# Altium project ZYNQ7000_Core_V1.1.PrjPcb (part 1 of 2)
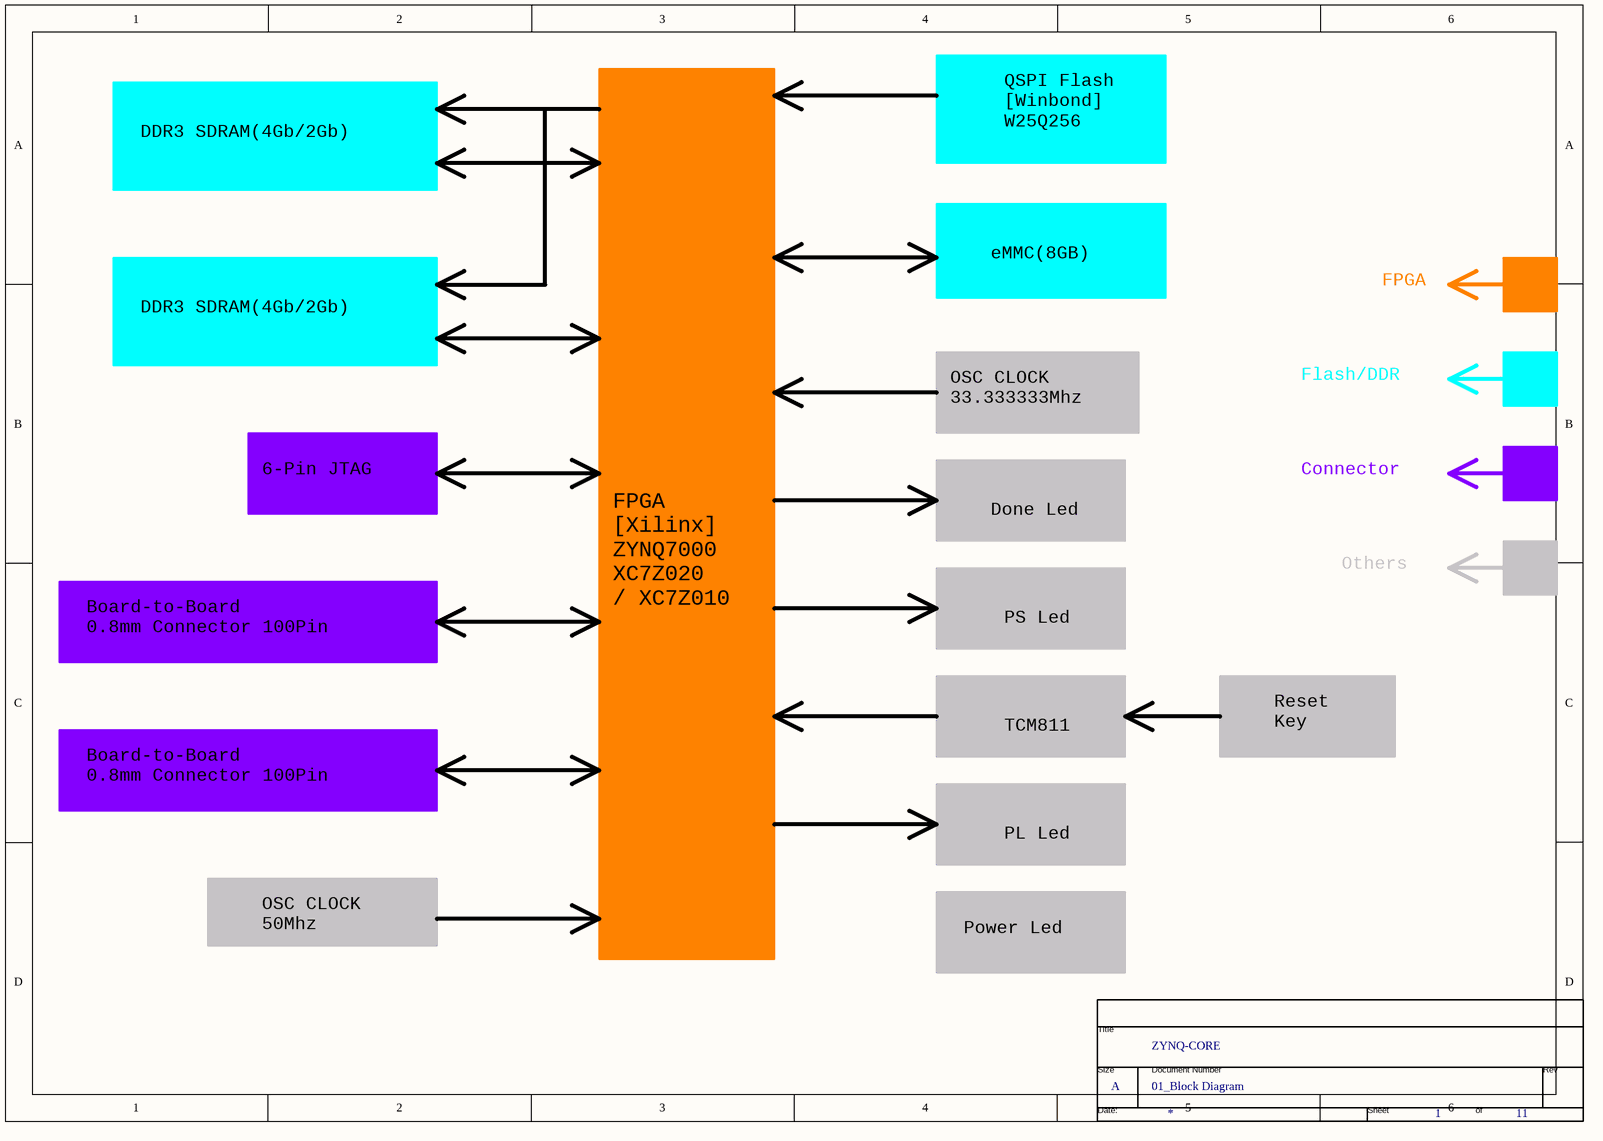
[diagram p0: 01_Block Diagram.SchDoc]
11 sheets, 361 parts. Net scope: global (net labels, ports and power ports of the same name join across sheets).
Board file: ZYNQ7000_Core_V1.1-Finish.PcbDoc
Sheets:
  01_Block Diagram.SchDoc
  02_FPGA Bank0.SchDoc
  03_Bank13_Bank34_Bank35.SchDoc
  04_FPGA Bank500_Bank501.SchDoc
  05_FPGA Bank502.SchDoc
  06_FPGA POWER.SchDoc
  07_DDR3.SchDoc
  08_eMMC.SchDoc
  09_POWER.SchDoc
  10_Ethernet-YT8521SC_CA.SchDoc
  11_CONNECTOR.SchDoc

## Sheet 01_Block Diagram.SchDoc
size 297 x 209 mm

### Parts
(Parts that share a designator on the sheet are numbered #1, #2 ... from top to bottom, then left to right.)
*#1  Page Count: 11  Page Number: 1  Page Size: A  Title: ZYNQ-CORE  Doc: 01_Block Diagram  (hidden comment: TitleBlock0)  (graphical)

### Notes on the sheet
- DDR3 SDRAM(4Gb/2Gb)
- QSPI Flash
  [Winbond]
  W25Q256
- eMMC(8GB)
- FPGA
- Flash/DDR
- 6-Pin JTAG
- OSC CLOCK
  33.333333Mhz
- Connector
- Done Led
- Others
- Board-to-Board
  0.8mm Connector 100Pin
- FPGA
  [Xilinx]
  ZYNQ7000
  XC7Z020
  / XC7Z010
- PS Led
- TCM811
- Reset
  Key
- PL Led
- OSC CLOCK
  50Mhz
- Power Led
- (in symbol TitleBlock0) Title; Size; Document Number; Rev; Date:; Sheet; of

### Library data of the parts
*#1 = TitleBlock0: Page Create Date: March  8, 1995; Page Modify Date: *

## Sheet 02_FPGA Bank0.SchDoc
size 297 x 209 mm
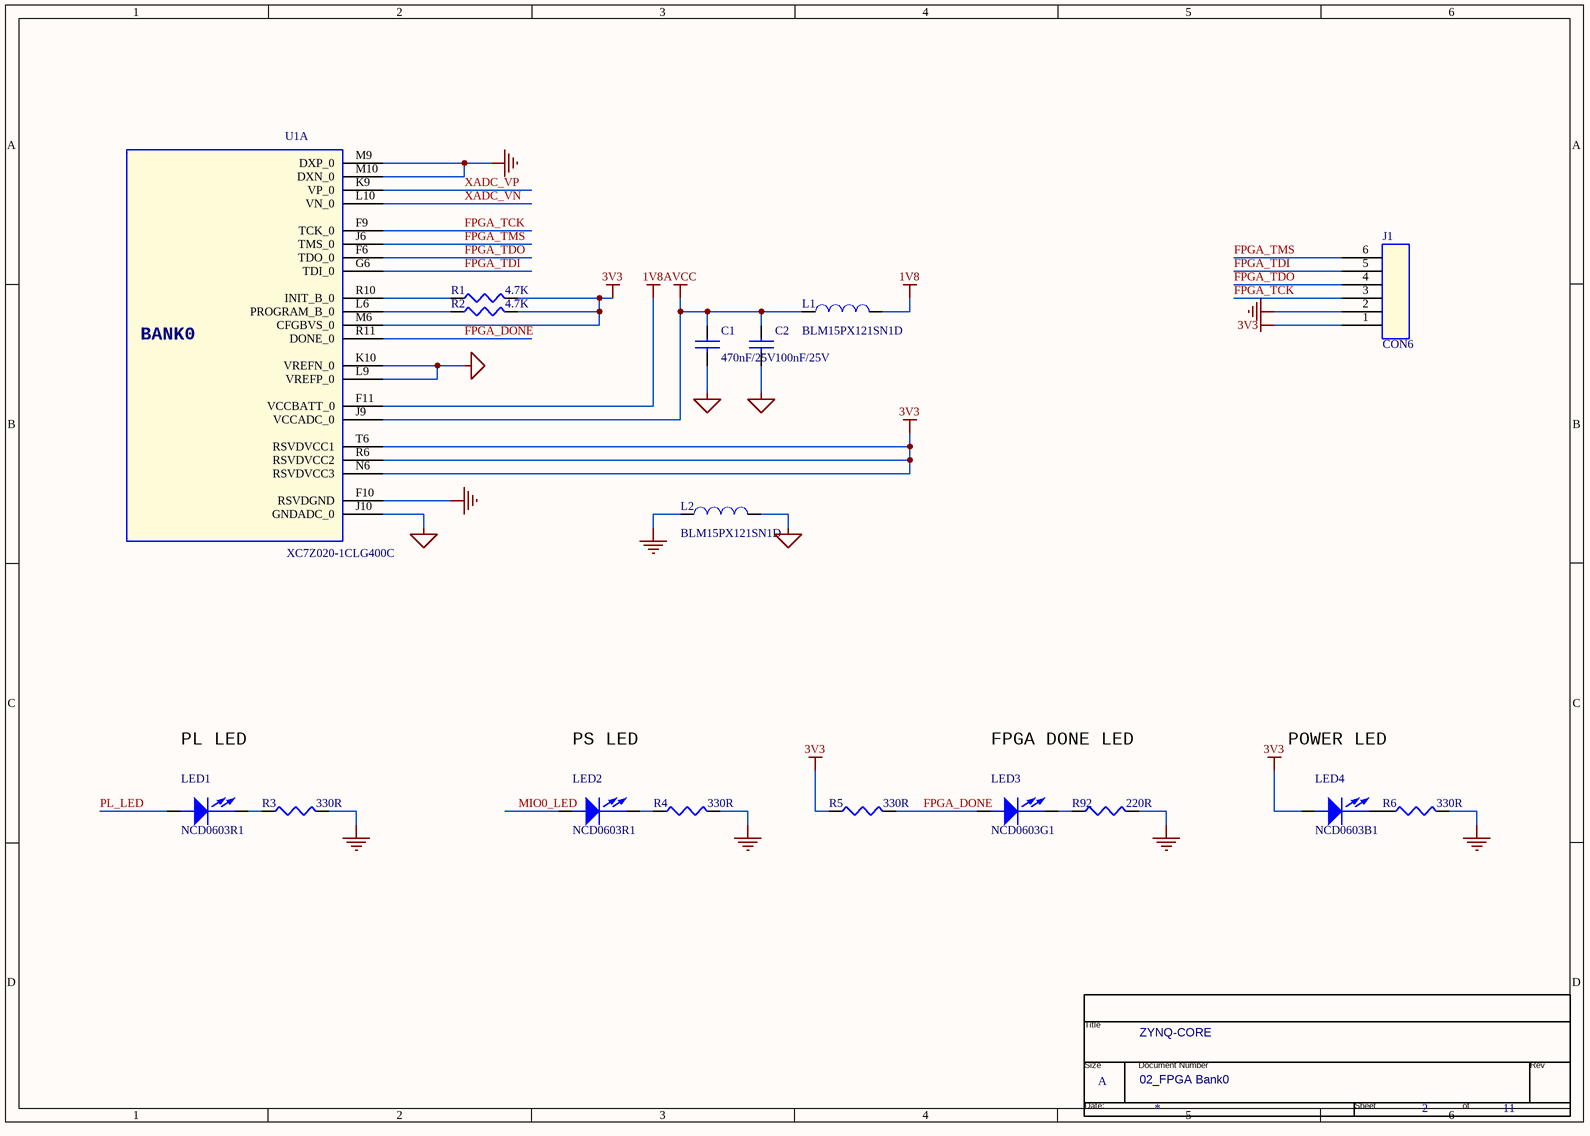
[diagram p1: 02_FPGA Bank0.SchDoc]

### Parts
(Parts that share a designator on the sheet are numbered #1, #2 ... from top to bottom, then left to right.)
*#2  Page Count: 11  Page Number: 2  Page Size: A  Title: ZYNQ-CORE  Doc: 02_FPGA Bank0  (hidden comment: TitleBlock0)  (graphical)
C1  470nF/25V  [C0402]
C2  100nF/25V  [C0402]
J1  CON6  [HDR1X6]
L1  BLM15PX121SN1D  [L0402]
L2  BLM15PX121SN1D  [L0402]
LED1  NCD0603R1  [LED0603_M_RED]
LED2  NCD0603R1  [LED0603_M_RED]
LED3  NCD0603G1  [LED0603_M_GREEN]
LED4  NCD0603B1  [LED0603_M_BLUE]
R1  4.7K  [R0402A]
R2  4.7K  [R0402A]
R3  330R  [R0402]
R4  330R  [R0402]
R5  330R  [R0402]
R6  330R  [R0402]
R92  220R  [R0402]
U1  XC7Z020-1CLG400C  [CLG400]  (part A of 9)

### Nets
1V8: L1.2 U1.F11(VCCBATT_0)
3V3: J1.1 LED4.1(ANODE) R1.2 R2.2 R5.1 U1.M6(CFGBVS_0) U1.N6(RSVDVCC3) U1.R6(RSVDVCC2) U1.T6(RSVDVCC1)
AGND: C1.2 C2.2 L2.2 U1.J10(GNDADC_0) U1.K10(VREFN_0) U1.L9(VREFP_0)
AVCC: C1.1 C2.1 L1.1 U1.J9(VCCADC_0)
GND: J1.2 L2.1 R3.2 R4.2 R6.2 R92.2 U1.F10(RSVDGND) U1.M9(DXP_0) U1.M10(DXN_0)
FPGA_DONE: LED3.1(ANODE) R5.2 U1.R11(DONE_0)
FPGA_TCK: J1.3 U1.F9(TCK_0)
FPGA_TDI: J1.5 U1.G6(TDI_0)
FPGA_TDO: J1.4 U1.F6(TDO_0)
FPGA_TMS: J1.6 U1.J6(TMS_0)
MIO0_LED: LED2.1(ANODE)
PL_LED: LED1.1(ANODE)
XADC_VN: U1.L10(VN_0)
XADC_VP: U1.K9(VP_0)
NetLED1_2: LED1.2(CATHODE) R3.1
NetLED2_2: LED2.2(CATHODE) R4.1
NetLED3_2: LED3.2(CATHODE) R92.1
NetLED4_2: LED4.2(CATHODE) R6.1
NetR1_1: R1.1 U1.R10(INIT_B_0)
NetR2_1: R2.1 U1.L6(PROGRAM_B_0)

### Notes on the sheet
- PL LED
- PS LED
- FPGA DONE LED
- POWER LED
- (in symbol TitleBlock0) Title; Size; Document Number; Rev; Date:; Sheet; of
- (in symbol Zynq7010/7020, part A) BANK0

### Library data of the parts
C1 C2 = CAP NP_Dup1: PCB Footprint: C0402
L1 L2 = INDUCTOR_Dup1: PCB Footprint: L0402
LED1 LED2 = LED: 红色; PCB Footprint: LED0805
LED3 = LED: 绿色; PCB Footprint: LED0805
LED4 = LED: 蓝色; PCB Footprint: LED0805
R1 R2 = RESISTOR_Dup1: PCB Footprint: R0402
R3-R6 R92 = RESISTOR_Dup1: PCB Footprint: R0402
U1 = Zynq7010/7020: PCB Footprint: CLG400
*#2 = TitleBlock0: Page Create Date: March  8, 1995; Page Modify Date: *
J1 = CON6: PCB Footprint: HDR1X6

## Sheet 03_Bank13_Bank34_Bank35.SchDoc
size A3
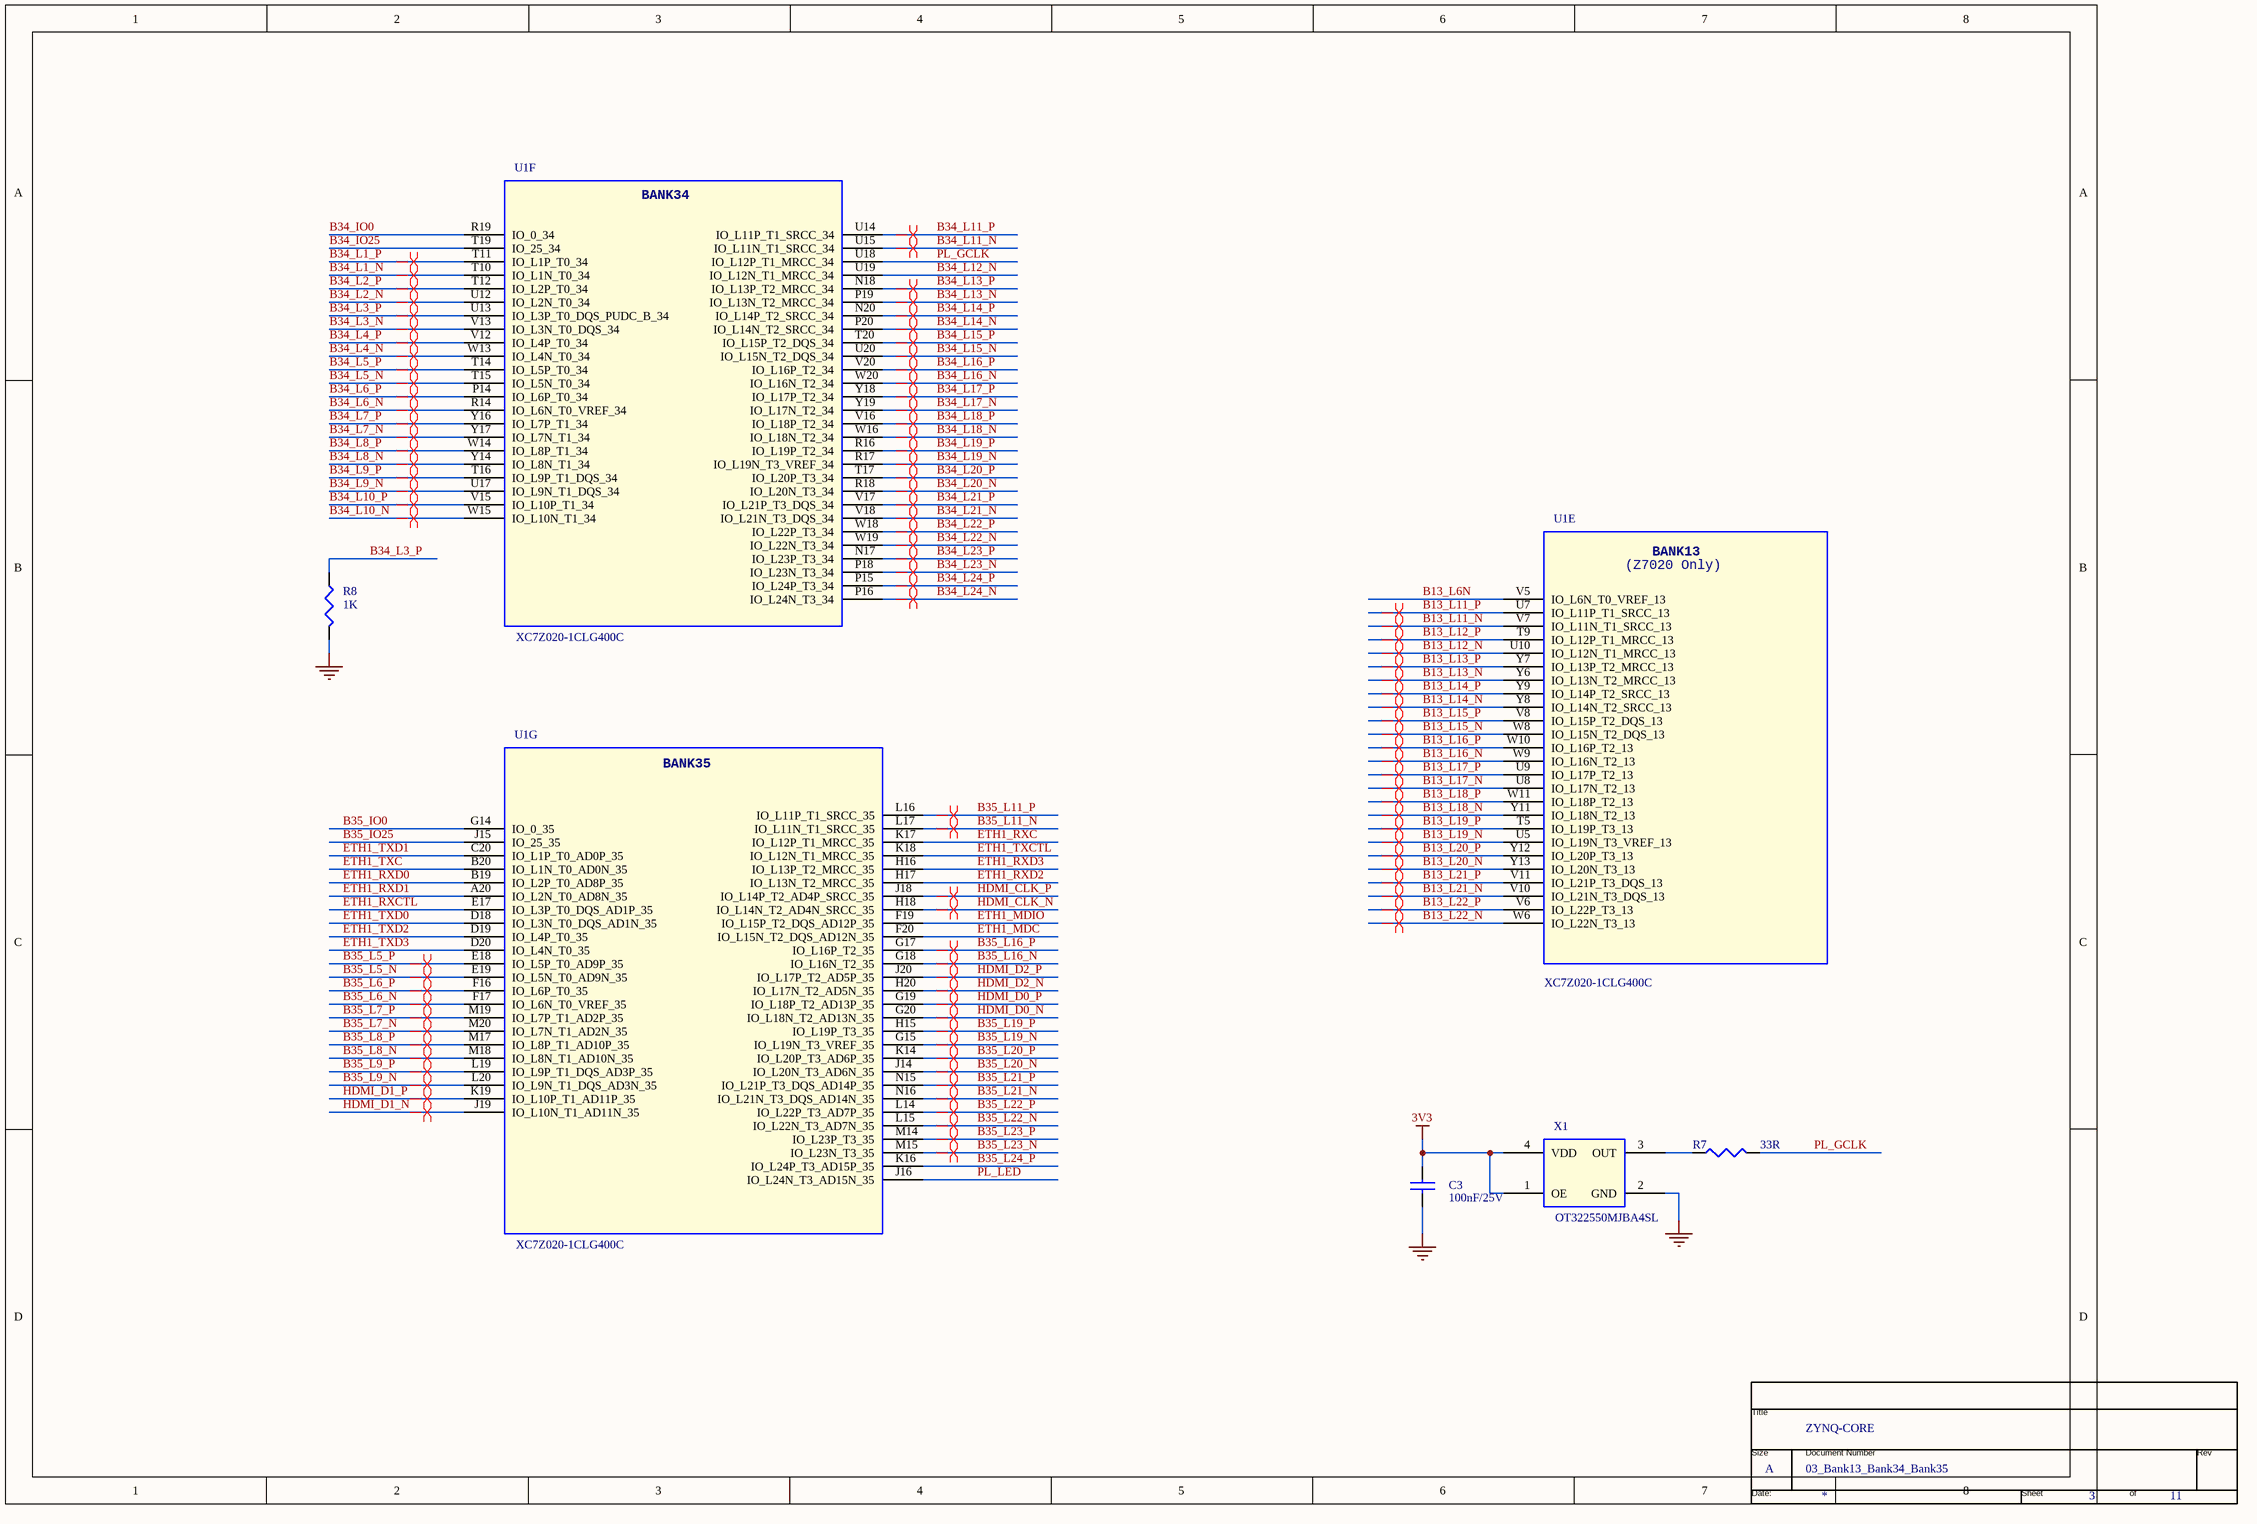
[diagram p2: 03_Bank13_Bank34_Bank35.SchDoc]

### Parts
(Parts that share a designator on the sheet are numbered #1, #2 ... from top to bottom, then left to right.)
*#3  Page Count: 11  Page Number: 3  Page Size: A  Title: ZYNQ-CORE  Doc: 03_Bank13_Bank34_Bank35  (hidden comment: TitleBlock0)  (graphical)
C3  100nF/25V  [C0402]
R7  33R  [R0402]
R8  1K  [R0402A]
U1  XC7Z020-1CLG400C  [CLG400]  (parts E,F,G of 9)
X1  OT322550MJBA4SL  [OSC3_2X2_5]

### Nets
3V3: C3.1 X1.1(OE) X1.4(VDD)
GND: C3.2 R8.2 X1.2(GND)
B13_L6N: U1.V5(IO_L6N_T0_VREF_13)
B13_L11_N: U1.V7(IO_L11N_T1_SRCC_13)
B13_L11_P: U1.U7(IO_L11P_T1_SRCC_13)
B13_L12_N: U1.U10(IO_L12N_T1_MRCC_13)
B13_L12_P: U1.T9(IO_L12P_T1_MRCC_13)
B13_L13_N: U1.Y6(IO_L13N_T2_MRCC_13)
B13_L13_P: U1.Y7(IO_L13P_T2_MRCC_13)
B13_L14_N: U1.Y8(IO_L14N_T2_SRCC_13)
B13_L14_P: U1.Y9(IO_L14P_T2_SRCC_13)
B13_L15_N: U1.W8(IO_L15N_T2_DQS_13)
B13_L15_P: U1.V8(IO_L15P_T2_DQS_13)
B13_L16_N: U1.W9(IO_L16N_T2_13)
B13_L16_P: U1.W10(IO_L16P_T2_13)
B13_L17_N: U1.U8(IO_L17N_T2_13)
B13_L17_P: U1.U9(IO_L17P_T2_13)
B13_L18_N: U1.Y11(IO_L18N_T2_13)
B13_L18_P: U1.W11(IO_L18P_T2_13)
B13_L19_N: U1.U5(IO_L19N_T3_VREF_13)
B13_L19_P: U1.T5(IO_L19P_T3_13)
B13_L20_N: U1.Y13(IO_L20N_T3_13)
B13_L20_P: U1.Y12(IO_L20P_T3_13)
B13_L21_N: U1.V10(IO_L21N_T3_DQS_13)
B13_L21_P: U1.V11(IO_L21P_T3_DQS_13)
B13_L22_N: U1.W6(IO_L22N_T3_13)
B13_L22_P: U1.V6(IO_L22P_T3_13)
B34_IO0: U1.R19(IO_0_34)
B34_IO25: U1.T19(IO_25_34)
B34_L1_N: U1.T10(IO_L1N_T0_34)
B34_L1_P: U1.T11(IO_L1P_T0_34)
B34_L2_N: U1.U12(IO_L2N_T0_34)
B34_L2_P: U1.T12(IO_L2P_T0_34)
B34_L3_N: U1.V13(IO_L3N_T0_DQS_34)
B34_L3_P: R8.1 U1.U13(IO_L3P_T0_DQS_PUDC_B_34)
B34_L4_N: U1.W13(IO_L4N_T0_34)
B34_L4_P: U1.V12(IO_L4P_T0_34)
B34_L5_N: U1.T15(IO_L5N_T0_34)
B34_L5_P: U1.T14(IO_L5P_T0_34)
B34_L6_N: U1.R14(IO_L6N_T0_VREF_34)
B34_L6_P: U1.P14(IO_L6P_T0_34)
B34_L7_N: U1.Y17(IO_L7N_T1_34)
B34_L7_P: U1.Y16(IO_L7P_T1_34)
B34_L8_N: U1.Y14(IO_L8N_T1_34)
B34_L8_P: U1.W14(IO_L8P_T1_34)
B34_L9_N: U1.U17(IO_L9N_T1_DQS_34)
B34_L9_P: U1.T16(IO_L9P_T1_DQS_34)
B34_L10_N: U1.W15(IO_L10N_T1_34)
B34_L10_P: U1.V15(IO_L10P_T1_34)
B34_L11_N: U1.U15(IO_L11N_T1_SRCC_34)
B34_L11_P: U1.U14(IO_L11P_T1_SRCC_34)
B34_L12_N: U1.U19(IO_L12N_T1_MRCC_34)
B34_L13_N: U1.P19(IO_L13N_T2_MRCC_34)
B34_L13_P: U1.N18(IO_L13P_T2_MRCC_34)
B34_L14_N: U1.P20(IO_L14N_T2_SRCC_34)
B34_L14_P: U1.N20(IO_L14P_T2_SRCC_34)
B34_L15_N: U1.U20(IO_L15N_T2_DQS_34)
B34_L15_P: U1.T20(IO_L15P_T2_DQS_34)
B34_L16_N: U1.W20(IO_L16N_T2_34)
B34_L16_P: U1.V20(IO_L16P_T2_34)
B34_L17_N: U1.Y19(IO_L17N_T2_34)
B34_L17_P: U1.Y18(IO_L17P_T2_34)
B34_L18_N: U1.W16(IO_L18N_T2_34)
B34_L18_P: U1.V16(IO_L18P_T2_34)
B34_L19_N: U1.R17(IO_L19N_T3_VREF_34)
B34_L19_P: U1.R16(IO_L19P_T2_34)
B34_L20_N: U1.R18(IO_L20N_T3_34)
B34_L20_P: U1.T17(IO_L20P_T3_34)
B34_L21_N: U1.V18(IO_L21N_T3_DQS_34)
B34_L21_P: U1.V17(IO_L21P_T3_DQS_34)
B34_L22_N: U1.W19(IO_L22N_T3_34)
B34_L22_P: U1.W18(IO_L22P_T3_34)
B34_L23_N: U1.P18(IO_L23N_T3_34)
B34_L23_P: U1.N17(IO_L23P_T3_34)
B34_L24_N: U1.P16(IO_L24N_T3_34)
B34_L24_P: U1.P15(IO_L24P_T3_34)
B35_IO0: U1.G14(IO_0_35)
B35_IO25: U1.J15(IO_25_35)
B35_L5_N: U1.E19(IO_L5N_T0_AD9N_35)
B35_L5_P: U1.E18(IO_L5P_T0_AD9P_35)
B35_L6_N: U1.F17(IO_L6N_T0_VREF_35)
B35_L6_P: U1.F16(IO_L6P_T0_35)
B35_L7_N: U1.M20(IO_L7N_T1_AD2N_35)
B35_L7_P: U1.M19(IO_L7P_T1_AD2P_35)
B35_L8_N: U1.M18(IO_L8N_T1_AD10N_35)
B35_L8_P: U1.M17(IO_L8P_T1_AD10P_35)
B35_L9_N: U1.L20(IO_L9N_T1_DQS_AD3N_35)
B35_L9_P: U1.L19(IO_L9P_T1_DQS_AD3P_35)
B35_L11_N: U1.L17(IO_L11N_T1_SRCC_35)
B35_L11_P: U1.L16(IO_L11P_T1_SRCC_35)
B35_L16_N: U1.G18(IO_L16N_T2_35)
B35_L16_P: U1.G17(IO_L16P_T2_35)
B35_L19_N: U1.G15(IO_L19N_T3_VREF_35)
B35_L19_P: U1.H15(IO_L19P_T3_35)
B35_L20_N: U1.J14(IO_L20N_T3_AD6N_35)
B35_L20_P: U1.K14(IO_L20P_T3_AD6P_35)
B35_L21_N: U1.N16(IO_L21N_T3_DQS_AD14N_35)
B35_L21_P: U1.N15(IO_L21P_T3_DQS_AD14P_35)
B35_L22_N: U1.L15(IO_L22N_T3_AD7N_35)
B35_L22_P: U1.L14(IO_L22P_T3_AD7P_35)
B35_L23_N: U1.M15(IO_L23N_T3_35)
B35_L23_P: U1.M14(IO_L23P_T3_35)
B35_L24_P: U1.K16(IO_L24P_T3_AD15P_35)
ETH1_MDC: U1.F20(IO_L15N_T2_DQS_AD12N_35)
ETH1_MDIO: U1.F19(IO_L15P_T2_DQS_AD12P_35)
ETH1_RXC: U1.K17(IO_L12P_T1_MRCC_35)
ETH1_RXCTL: U1.E17(IO_L3P_T0_DQS_AD1P_35)
ETH1_RXD0: U1.B19(IO_L2P_T0_AD8P_35)
ETH1_RXD1: U1.A20(IO_L2N_T0_AD8N_35)
ETH1_RXD2: U1.H17(IO_L13N_T2_MRCC_35)
ETH1_RXD3: U1.H16(IO_L13P_T2_MRCC_35)
ETH1_TXC: U1.B20(IO_L1N_T0_AD0N_35)
ETH1_TXCTL: U1.K18(IO_L12N_T1_MRCC_35)
ETH1_TXD0: U1.D18(IO_L3N_T0_DQS_AD1N_35)
ETH1_TXD1: U1.C20(IO_L1P_T0_AD0P_35)
ETH1_TXD2: U1.D19(IO_L4P_T0_35)
ETH1_TXD3: U1.D20(IO_L4N_T0_35)
HDMI_CLK_N: U1.H18(IO_L14N_T2_AD4N_SRCC_35)
HDMI_CLK_P: U1.J18(IO_L14P_T2_AD4P_SRCC_35)
HDMI_D0_N: U1.G20(IO_L18N_T2_AD13N_35)
HDMI_D0_P: U1.G19(IO_L18P_T2_AD13P_35)
HDMI_D1_N: U1.J19(IO_L10N_T1_AD11N_35)
HDMI_D1_P: U1.K19(IO_L10P_T1_AD11P_35)
HDMI_D2_N: U1.H20(IO_L17N_T2_AD5N_35)
HDMI_D2_P: U1.J20(IO_L17P_T2_AD5P_35)
PL_GCLK: R7.2 U1.U18(IO_L12P_T1_MRCC_34)
PL_LED: U1.J16(IO_L24N_T3_AD15N_35)
NetR7_1: R7.1 X1.3(OUT)

### Layout directives
differential pair: B13_L11_N, B13_L11_P, B13_L12_N, B13_L12_P, B13_L13_N, B13_L13_P, B13_L14_N, B13_L14_P, B13_L15_N, B13_L15_P, B13_L16_N, B13_L16_P, B13_L17_N, B13_L17_P, B13_L18_N, B13_L18_P, B13_L19_N, B13_L19_P, B13_L20_N, B13_L20_P, B13_L21_N, B13_L21_P, B13_L22_N, B13_L22_P, B34_L1_N, B34_L1_P, B34_L2_N, B34_L2_P, B34_L3_N, B34_L3_P, B34_L4_N, B34_L4_P, B34_L5_N, B34_L5_P, B34_L6_N, B34_L6_P, B34_L7_N, B34_L7_P, B34_L8_N, B34_L8_P, B34_L9_N, B34_L9_P, B34_L10_N, B34_L10_P, B34_L11_N, B34_L11_P, B34_L13_N, B34_L13_P, B34_L14_N, B34_L14_P, B34_L15_N, B34_L15_P, B34_L16_N, B34_L16_P, B34_L17_N, B34_L17_P, B34_L18_N, B34_L18_P, B34_L19_N, B34_L19_P, B34_L20_N, B34_L20_P, B34_L21_N, B34_L21_P, B34_L22_N, B34_L22_P, B34_L23_N, B34_L23_P, B34_L24_N, B34_L24_P, B35_L5_N, B35_L5_P, B35_L6_N, B35_L6_P, B35_L7_N, B35_L7_P, B35_L8_N, B35_L8_P, B35_L9_N, B35_L9_P, B35_L11_N, B35_L11_P, B35_L16_N, B35_L16_P, B35_L19_N, B35_L19_P, B35_L20_N, B35_L20_P, B35_L21_N, B35_L21_P, B35_L22_N, B35_L22_P, B35_L23_N, B35_L23_P, HDMI_CLK_N, HDMI_CLK_P, HDMI_D0_N, HDMI_D0_P, HDMI_D1_N, HDMI_D1_P, HDMI_D2_N, HDMI_D2_P

### Notes on the sheet
- (in symbol TitleBlock0) Title; Size; Document Number; Rev; Date:; Sheet; of
- (in symbol Zynq7010/7020, part E) BANK13; (Z7020 Only)
- (in symbol Zynq7010/7020, part F) BANK34
- (in symbol Zynq7010/7020, part G) BANK35

### Library data of the parts
C3 = CAP NP_Dup1: PCB Footprint: C0402
R7 = RESISTOR_Dup1: PCB Footprint: R0402
R8 = RESISTOR_Dup1: PCB Footprint: R0402
U1 = Zynq7010/7020: PCB Footprint: CLG400
X1 = crystal_active: 50MHZ; PCB Footprint: OSC3_2X2_5
*#3 = TitleBlock0: Page Create Date: March  8, 1995; Page Modify Date: *

## Sheet 04_FPGA Bank500_Bank501.SchDoc
size 297 x 209 mm
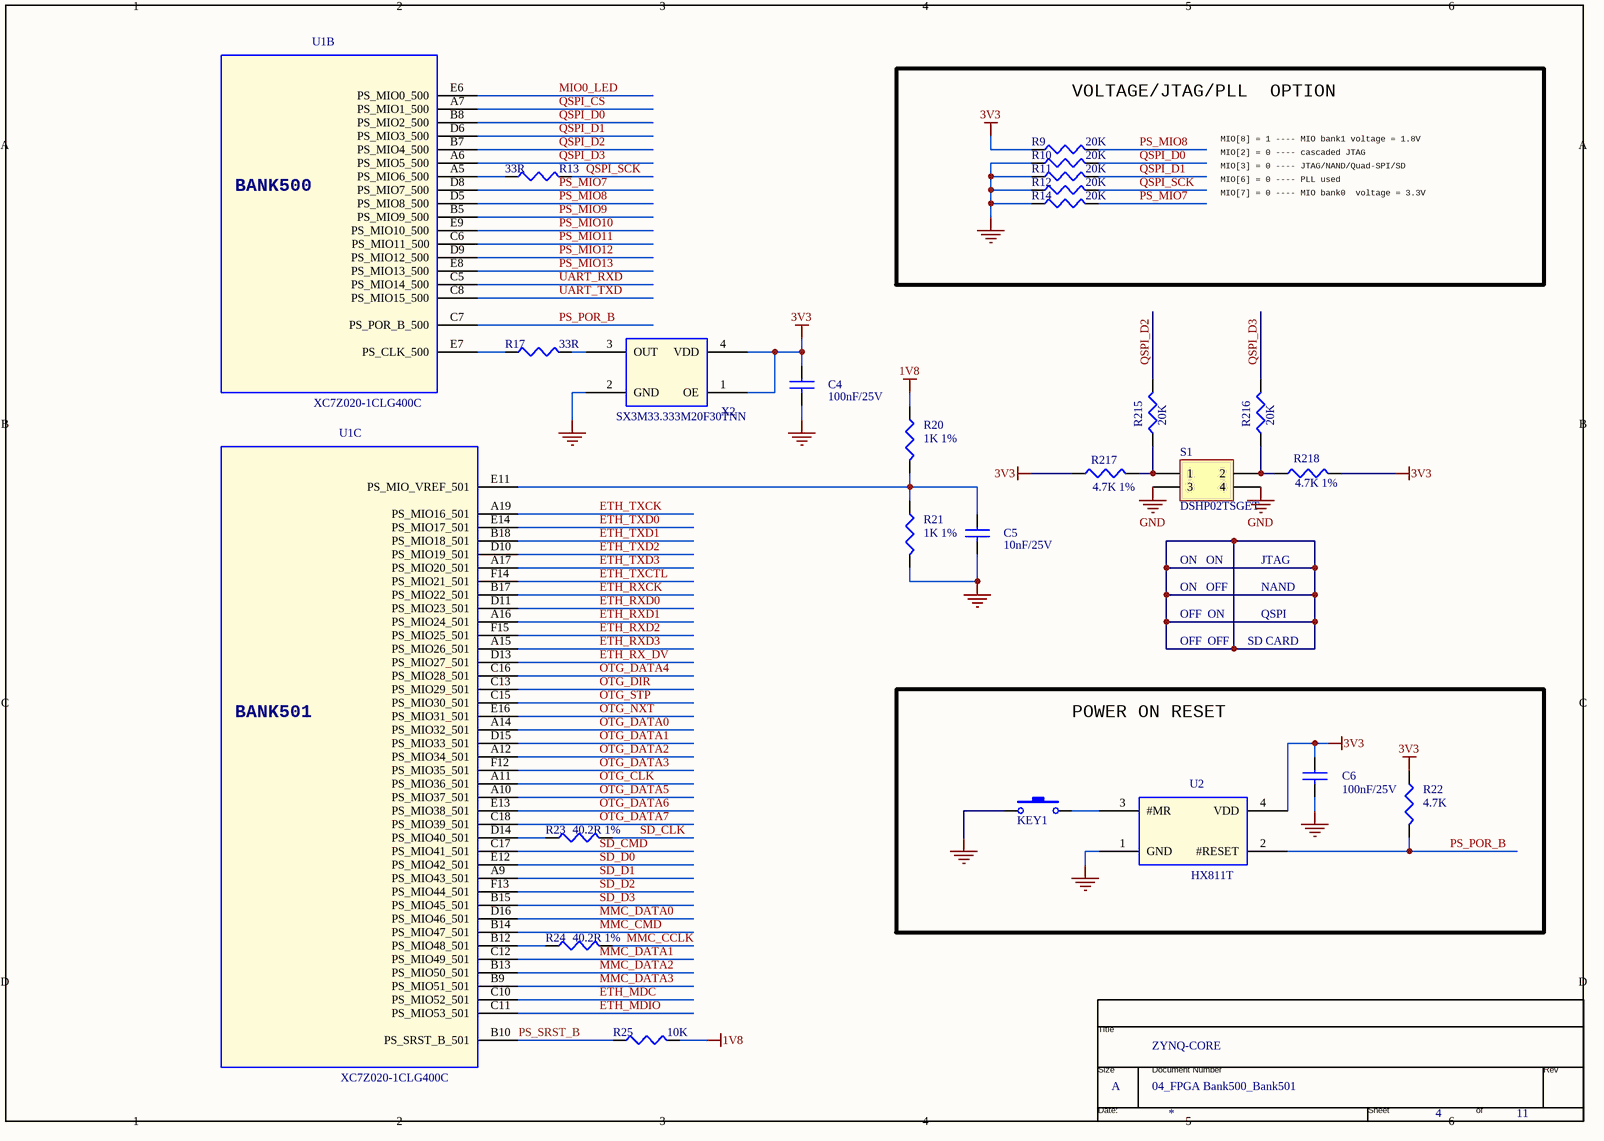
[diagram p3: 04_FPGA Bank500_Bank501.SchDoc]

### Parts
(Parts that share a designator on the sheet are numbered #1, #2 ... from top to bottom, then left to right.)
*#4  Page Count: 11  Page Number: 4  Page Size: A  Title: ZYNQ-CORE  Doc: 04_FPGA Bank500_Bank501  (hidden comment: TitleBlock0)  (graphical)
C4  100nF/25V  [C0402]
C5  10nF/25V  [C0402]
C6  100nF/25V  [C0402]
KEY1  TS-1071AD-A1B3-D4  [KEY_3*4*2]  (value not drawn)
R9  20K  [R0402]
R10  20K  [R0402]
R11  20K  [R0402]
R12  20K  [R0402]
R13  33R  [R0402]
R14  20K  [R0402]
R17  33R  [R0402]
R20  1K 1%  [R0402]
R21  1K 1%  [R0402]
R22  4.7K  [R0402]
R23  40.2R 1%  [R0402]
R24  40.2R 1%  [R0402]
R25  10K  [R0402]
R215  20K  [R0402]
R216  20K  [R0402]
R217  4.7K 1%  [R0402]
R218  4.7K 1%  [R0402]
S1  DSHP02TSGET  [KE-1.27-2Pin]
U1  XC7Z020-1CLG400C  [CLG400]  (parts B,C of 9)
U2  HX811T  [TCM811TERCTR]
X2  SX3M33.333M20F30TNN  [OSC3_2X2_5]

### Blocks framed on the sheet
VOLTAGE/JTAG/PLL  OPTION: R9-R12 R14
POWER ON RESET: C6 KEY1 R22 U2

### Nets
1V8: R20.1 R25.2
3V3: C4.1 C6.1 R9.1 R22.1 R217.1 R218.2 U2.4(VDD) X2.1(OE) X2.4(VDD)
GND: C4.2 C5.2 C6.2 KEY1.1 R10.1 R11.1 R12.1 R14.1 R21.2 S1.3 S1.4 U2.1(GND) X2.2(GND)
ETH_MDC: U1.C10(PS_MIO52_501)
ETH_MDIO: U1.C11(PS_MIO53_501)
ETH_RX_DV: U1.D13(PS_MIO27_501)
ETH_RXCK: U1.B17(PS_MIO22_501)
ETH_RXD0: U1.D11(PS_MIO23_501)
ETH_RXD1: U1.A16(PS_MIO24_501)
ETH_RXD2: U1.F15(PS_MIO25_501)
ETH_RXD3: U1.A15(PS_MIO26_501)
ETH_TXCK: U1.A19(PS_MIO16_501)
ETH_TXCTL: U1.F14(PS_MIO21_501)
ETH_TXD0: U1.E14(PS_MIO17_501)
ETH_TXD1: U1.B18(PS_MIO18_501)
ETH_TXD2: U1.D10(PS_MIO19_501)
ETH_TXD3: U1.A17(PS_MIO20_501)
MIO0_LED: U1.E6(PS_MIO0_500)
MMC_CCLK: R24.2
MMC_CMD: U1.B14(PS_MIO47_501)
MMC_DATA0: U1.D16(PS_MIO46_501)
MMC_DATA1: U1.C12(PS_MIO49_501)
MMC_DATA2: U1.B13(PS_MIO50_501)
MMC_DATA3: U1.B9(PS_MIO51_501)
OTG_CLK: U1.A11(PS_MIO36_501)
OTG_DATA0: U1.A14(PS_MIO32_501)
OTG_DATA1: U1.D15(PS_MIO33_501)
OTG_DATA2: U1.A12(PS_MIO34_501)
OTG_DATA3: U1.F12(PS_MIO35_501)
OTG_DATA4: U1.C16(PS_MIO28_501)
OTG_DATA5: U1.A10(PS_MIO37_501)
OTG_DATA6: U1.E13(PS_MIO38_501)
OTG_DATA7: U1.C18(PS_MIO39_501)
OTG_DIR: U1.C13(PS_MIO29_501)
OTG_NXT: U1.E16(PS_MIO31_501)
OTG_STP: U1.C15(PS_MIO30_501)
PS_MIO7: R14.2 U1.D8(PS_MIO7_500)
PS_MIO8: R9.2 U1.D5(PS_MIO8_500)
PS_MIO9: U1.B5(PS_MIO9_500)
PS_MIO10: U1.E9(PS_MIO10_500)
PS_MIO11: U1.C6(PS_MIO11_500)
PS_MIO12: U1.D9(PS_MIO12_500)
PS_MIO13: U1.E8(PS_MIO13_500)
PS_POR_B: R22.2 U1.C7(PS_POR_B_500) U2.2(#RESET)
PS_SRST_B: R25.1 U1.B10(PS_SRST_B_501)
QSPI_CS: U1.A7(PS_MIO1_500)
QSPI_D0: R10.2 U1.B8(PS_MIO2_500)
QSPI_D1: R11.2 U1.D6(PS_MIO3_500)
QSPI_D2: R215.2 U1.B7(PS_MIO4_500)
QSPI_D3: R216.2 U1.A6(PS_MIO5_500)
QSPI_SCK: R12.2 R13.2
SD_CLK: R23.2
SD_CMD: U1.C17(PS_MIO41_501)
SD_D0: U1.E12(PS_MIO42_501)
SD_D1: U1.A9(PS_MIO43_501)
SD_D2: U1.F13(PS_MIO44_501)
SD_D3: U1.B15(PS_MIO45_501)
UART_RXD: U1.C5(PS_MIO14_500)
UART_TXD: U1.C8(PS_MIO15_500)
NetC5_1: C5.1 R20.2 R21.1 U1.E11(PS_MIO_VREF_501)
NetKEY1_2: KEY1.2 U2.3(#MR)
NetR13_1: R13.1 U1.A5(PS_MIO6_500)
NetR17_1: R17.1 U1.E7(PS_CLK_500)
NetR17_2: R17.2 X2.3(OUT)
NetR23_1: R23.1 U1.D14(PS_MIO40_501)
NetR24_1: R24.1 U1.B12(PS_MIO48_501)
NetR215_1: R215.1 R217.2 S1.1
NetR216_1: R216.1 R218.1 S1.2

### Notes on the sheet
- MIO[8] = 1 ---- MIO bank1 voltage = 1.8V
- MIO[2] = 0 ---- cascaded JTAG
- MIO[3] = 0 ---- JTAG/NAND/Quad-SPI/SD
- MIO[6] = 0 ---- PLL used
- MIO[7] = 0 ---- MIO bank0  voltage = 3.3V
- ON   ON
- ON   OFF
- NAND
- JTAG
- OFF  ON
- OFF  OFF
- SD CARD
- QSPI
- (in symbol TitleBlock0) Title; Size; Document Number; Rev; Date:; Sheet; of
- (in symbol Zynq7010/7020, part B) BANK500
- (in symbol Zynq7010/7020, part C) BANK501

### Library data of the parts
C4-C6 = CAP NP_Dup1: PCB Footprint: C0402
KEY1 = switch-anniu
R9-R14 R17 R20-R25 R215-R218 = RESISTOR_Dup1: PCB Footprint: R0402
S1 = Header 2X2: 拨码开关; LatestRevisionDate: 17-Jul-2002; LatestRevisionNote: Re-released for DXP Platform.; Publisher: Altium Limited
U1 = Zynq7010/7020: PCB Footprint: CLG400
U2 = TCM811TERCTR: PCB Footprint: TCM811TERCTR
X2 = crystal_active: PCB Footprint: OSC3_2X2_5
*#4 = TitleBlock0: Page Create Date: March  8, 1995; Page Modify Date: *

## Sheet 05_FPGA Bank502.SchDoc
size 297 x 209 mm
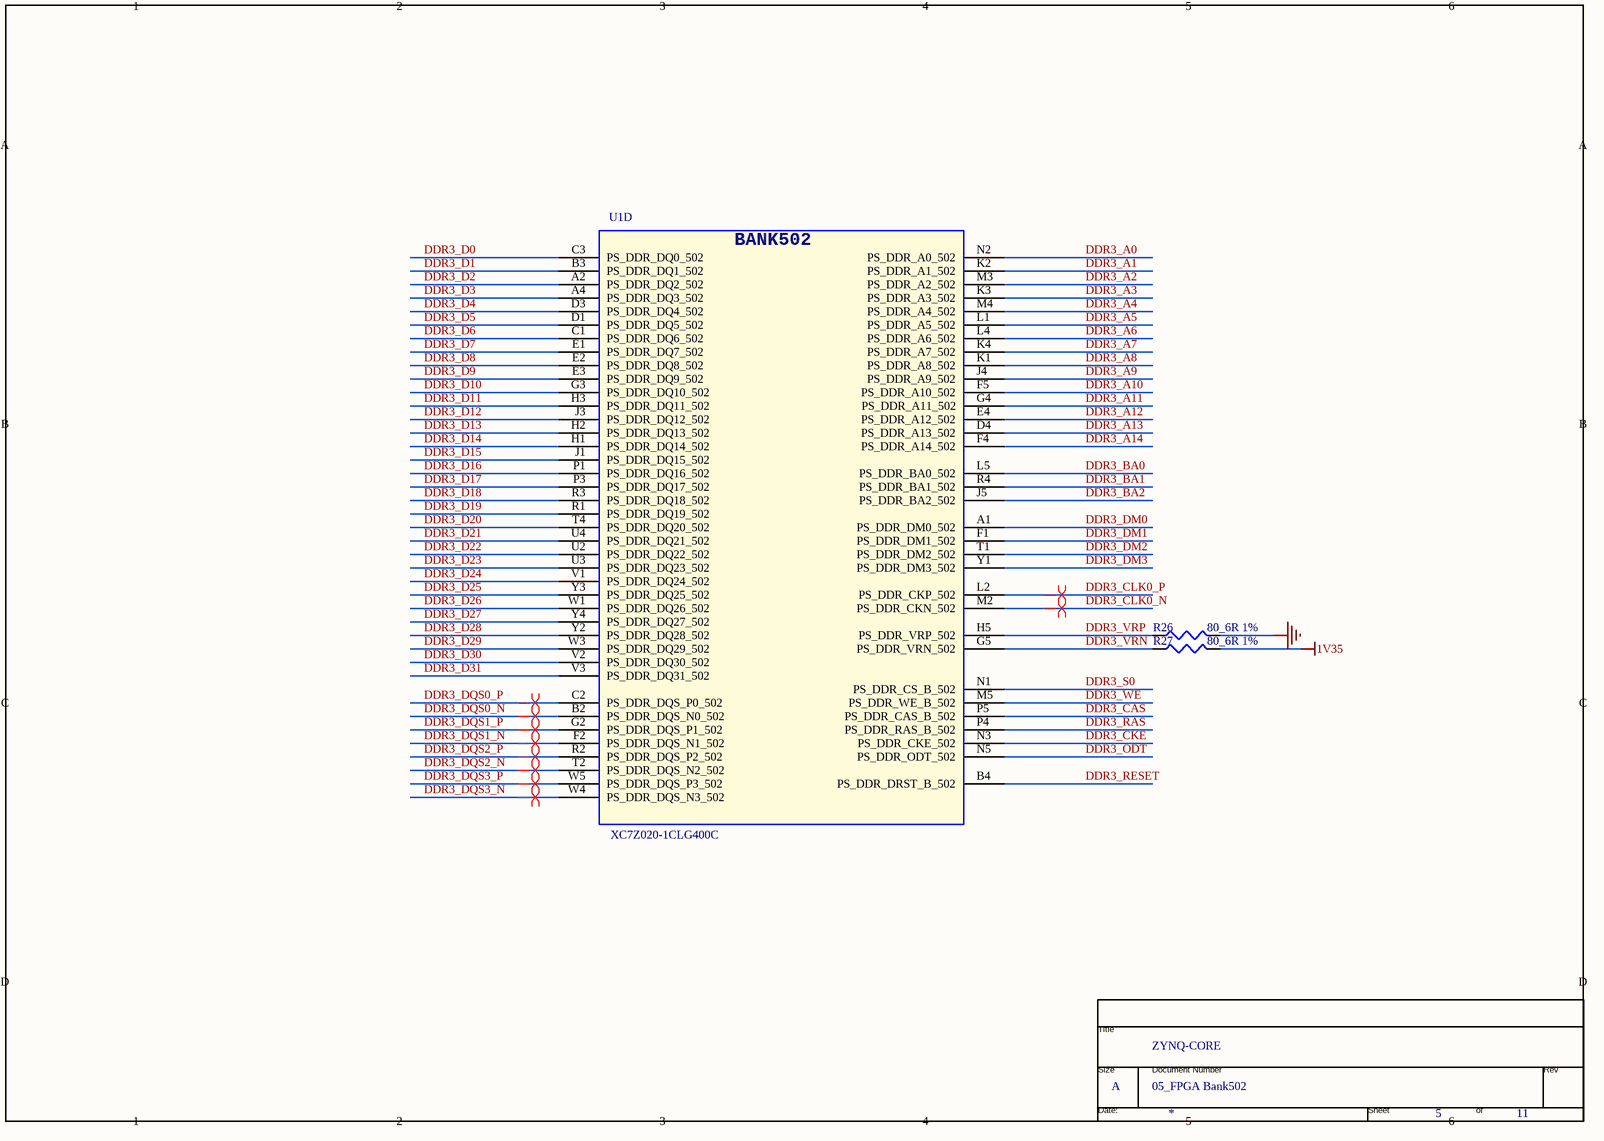
[diagram p4: 05_FPGA Bank502.SchDoc]

### Parts
(Parts that share a designator on the sheet are numbered #1, #2 ... from top to bottom, then left to right.)
*#5  Page Count: 11  Page Number: 5  Page Size: A  Title: ZYNQ-CORE  Doc: 05_FPGA Bank502  (hidden comment: TitleBlock0)  (graphical)
R26  80_6R 1%  [R0402A]
R27  80_6R 1%  [R0402A]
U1  XC7Z020-1CLG400C  [CLG400]  (part D of 9)

### Nets
1V35: R27.2
GND: R26.2
DDR3_A0: U1.N2(PS_DDR_A0_502)
DDR3_A1: U1.K2(PS_DDR_A1_502)
DDR3_A2: U1.M3(PS_DDR_A2_502)
DDR3_A3: U1.K3(PS_DDR_A3_502)
DDR3_A4: U1.M4(PS_DDR_A4_502)
DDR3_A5: U1.L1(PS_DDR_A5_502)
DDR3_A6: U1.L4(PS_DDR_A6_502)
DDR3_A7: U1.K4(PS_DDR_A7_502)
DDR3_A8: U1.K1(PS_DDR_A8_502)
DDR3_A9: U1.J4(PS_DDR_A9_502)
DDR3_A10: U1.F5(PS_DDR_A10_502)
DDR3_A11: U1.G4(PS_DDR_A11_502)
DDR3_A12: U1.E4(PS_DDR_A12_502)
DDR3_A13: U1.D4(PS_DDR_A13_502)
DDR3_A14: U1.F4(PS_DDR_A14_502)
DDR3_BA0: U1.L5(PS_DDR_BA0_502)
DDR3_BA1: U1.R4(PS_DDR_BA1_502)
DDR3_BA2: U1.J5(PS_DDR_BA2_502)
DDR3_CAS: U1.P5(PS_DDR_CAS_B_502)
DDR3_CKE: U1.N3(PS_DDR_CKE_502)
DDR3_CLK0_N: U1.M2(PS_DDR_CKN_502)
DDR3_CLK0_P: U1.L2(PS_DDR_CKP_502)
DDR3_D0: U1.C3(PS_DDR_DQ0_502)
DDR3_D1: U1.B3(PS_DDR_DQ1_502)
DDR3_D2: U1.A2(PS_DDR_DQ2_502)
DDR3_D3: U1.A4(PS_DDR_DQ3_502)
DDR3_D4: U1.D3(PS_DDR_DQ4_502)
DDR3_D5: U1.D1(PS_DDR_DQ5_502)
DDR3_D6: U1.C1(PS_DDR_DQ6_502)
DDR3_D7: U1.E1(PS_DDR_DQ7_502)
DDR3_D8: U1.E2(PS_DDR_DQ8_502)
DDR3_D9: U1.E3(PS_DDR_DQ9_502)
DDR3_D10: U1.G3(PS_DDR_DQ10_502)
DDR3_D11: U1.H3(PS_DDR_DQ11_502)
DDR3_D12: U1.J3(PS_DDR_DQ12_502)
DDR3_D13: U1.H2(PS_DDR_DQ13_502)
DDR3_D14: U1.H1(PS_DDR_DQ14_502)
DDR3_D15: U1.J1(PS_DDR_DQ15_502)
DDR3_D16: U1.P1(PS_DDR_DQ16_502)
DDR3_D17: U1.P3(PS_DDR_DQ17_502)
DDR3_D18: U1.R3(PS_DDR_DQ18_502)
DDR3_D19: U1.R1(PS_DDR_DQ19_502)
DDR3_D20: U1.T4(PS_DDR_DQ20_502)
DDR3_D21: U1.U4(PS_DDR_DQ21_502)
DDR3_D22: U1.U2(PS_DDR_DQ22_502)
DDR3_D23: U1.U3(PS_DDR_DQ23_502)
DDR3_D24: U1.V1(PS_DDR_DQ24_502)
DDR3_D25: U1.Y3(PS_DDR_DQ25_502)
DDR3_D26: U1.W1(PS_DDR_DQ26_502)
DDR3_D27: U1.Y4(PS_DDR_DQ27_502)
DDR3_D28: U1.Y2(PS_DDR_DQ28_502)
DDR3_D29: U1.W3(PS_DDR_DQ29_502)
DDR3_D30: U1.V2(PS_DDR_DQ30_502)
DDR3_D31: U1.V3(PS_DDR_DQ31_502)
DDR3_DM0: U1.A1(PS_DDR_DM0_502)
DDR3_DM1: U1.F1(PS_DDR_DM1_502)
DDR3_DM2: U1.T1(PS_DDR_DM2_502)
DDR3_DM3: U1.Y1(PS_DDR_DM3_502)
DDR3_DQS0_N: U1.B2(PS_DDR_DQS_N0_502)
DDR3_DQS0_P: U1.C2(PS_DDR_DQS_P0_502)
DDR3_DQS1_N: U1.F2(PS_DDR_DQS_N1_502)
DDR3_DQS1_P: U1.G2(PS_DDR_DQS_P1_502)
DDR3_DQS2_N: U1.T2(PS_DDR_DQS_N2_502)
DDR3_DQS2_P: U1.R2(PS_DDR_DQS_P2_502)
DDR3_DQS3_N: U1.W4(PS_DDR_DQS_N3_502)
DDR3_DQS3_P: U1.W5(PS_DDR_DQS_P3_502)
DDR3_ODT: U1.N5(PS_DDR_ODT_502)
DDR3_RAS: U1.P4(PS_DDR_RAS_B_502)
DDR3_RESET: U1.B4(PS_DDR_DRST_B_502)
DDR3_S0: U1.N1(PS_DDR_CS_B_502)
DDR3_VRN: R27.1 U1.G5(PS_DDR_VRN_502)
DDR3_VRP: R26.1 U1.H5(PS_DDR_VRP_502)
DDR3_WE: U1.M5(PS_DDR_WE_B_502)

### Layout directives
differential pair: DDR3_CLK0_N, DDR3_CLK0_P, DDR3_DQS0_N, DDR3_DQS0_P, DDR3_DQS1_N, DDR3_DQS1_P, DDR3_DQS2_N, DDR3_DQS2_P, DDR3_DQS3_N, DDR3_DQS3_P

### Notes on the sheet
- (in symbol TitleBlock0) Title; Size; Document Number; Rev; Date:; Sheet; of
- (in symbol Zynq7010/7020, part D) BANK502

### Library data of the parts
R26 R27 = RESISTOR_Dup1: PCB Footprint: R0402
U1 = Zynq7010/7020: PCB Footprint: CLG400
*#5 = TitleBlock0: Page Create Date: March  8, 1995; Page Modify Date: *

## Sheet 06_FPGA POWER.SchDoc
size 420 x 297 mm
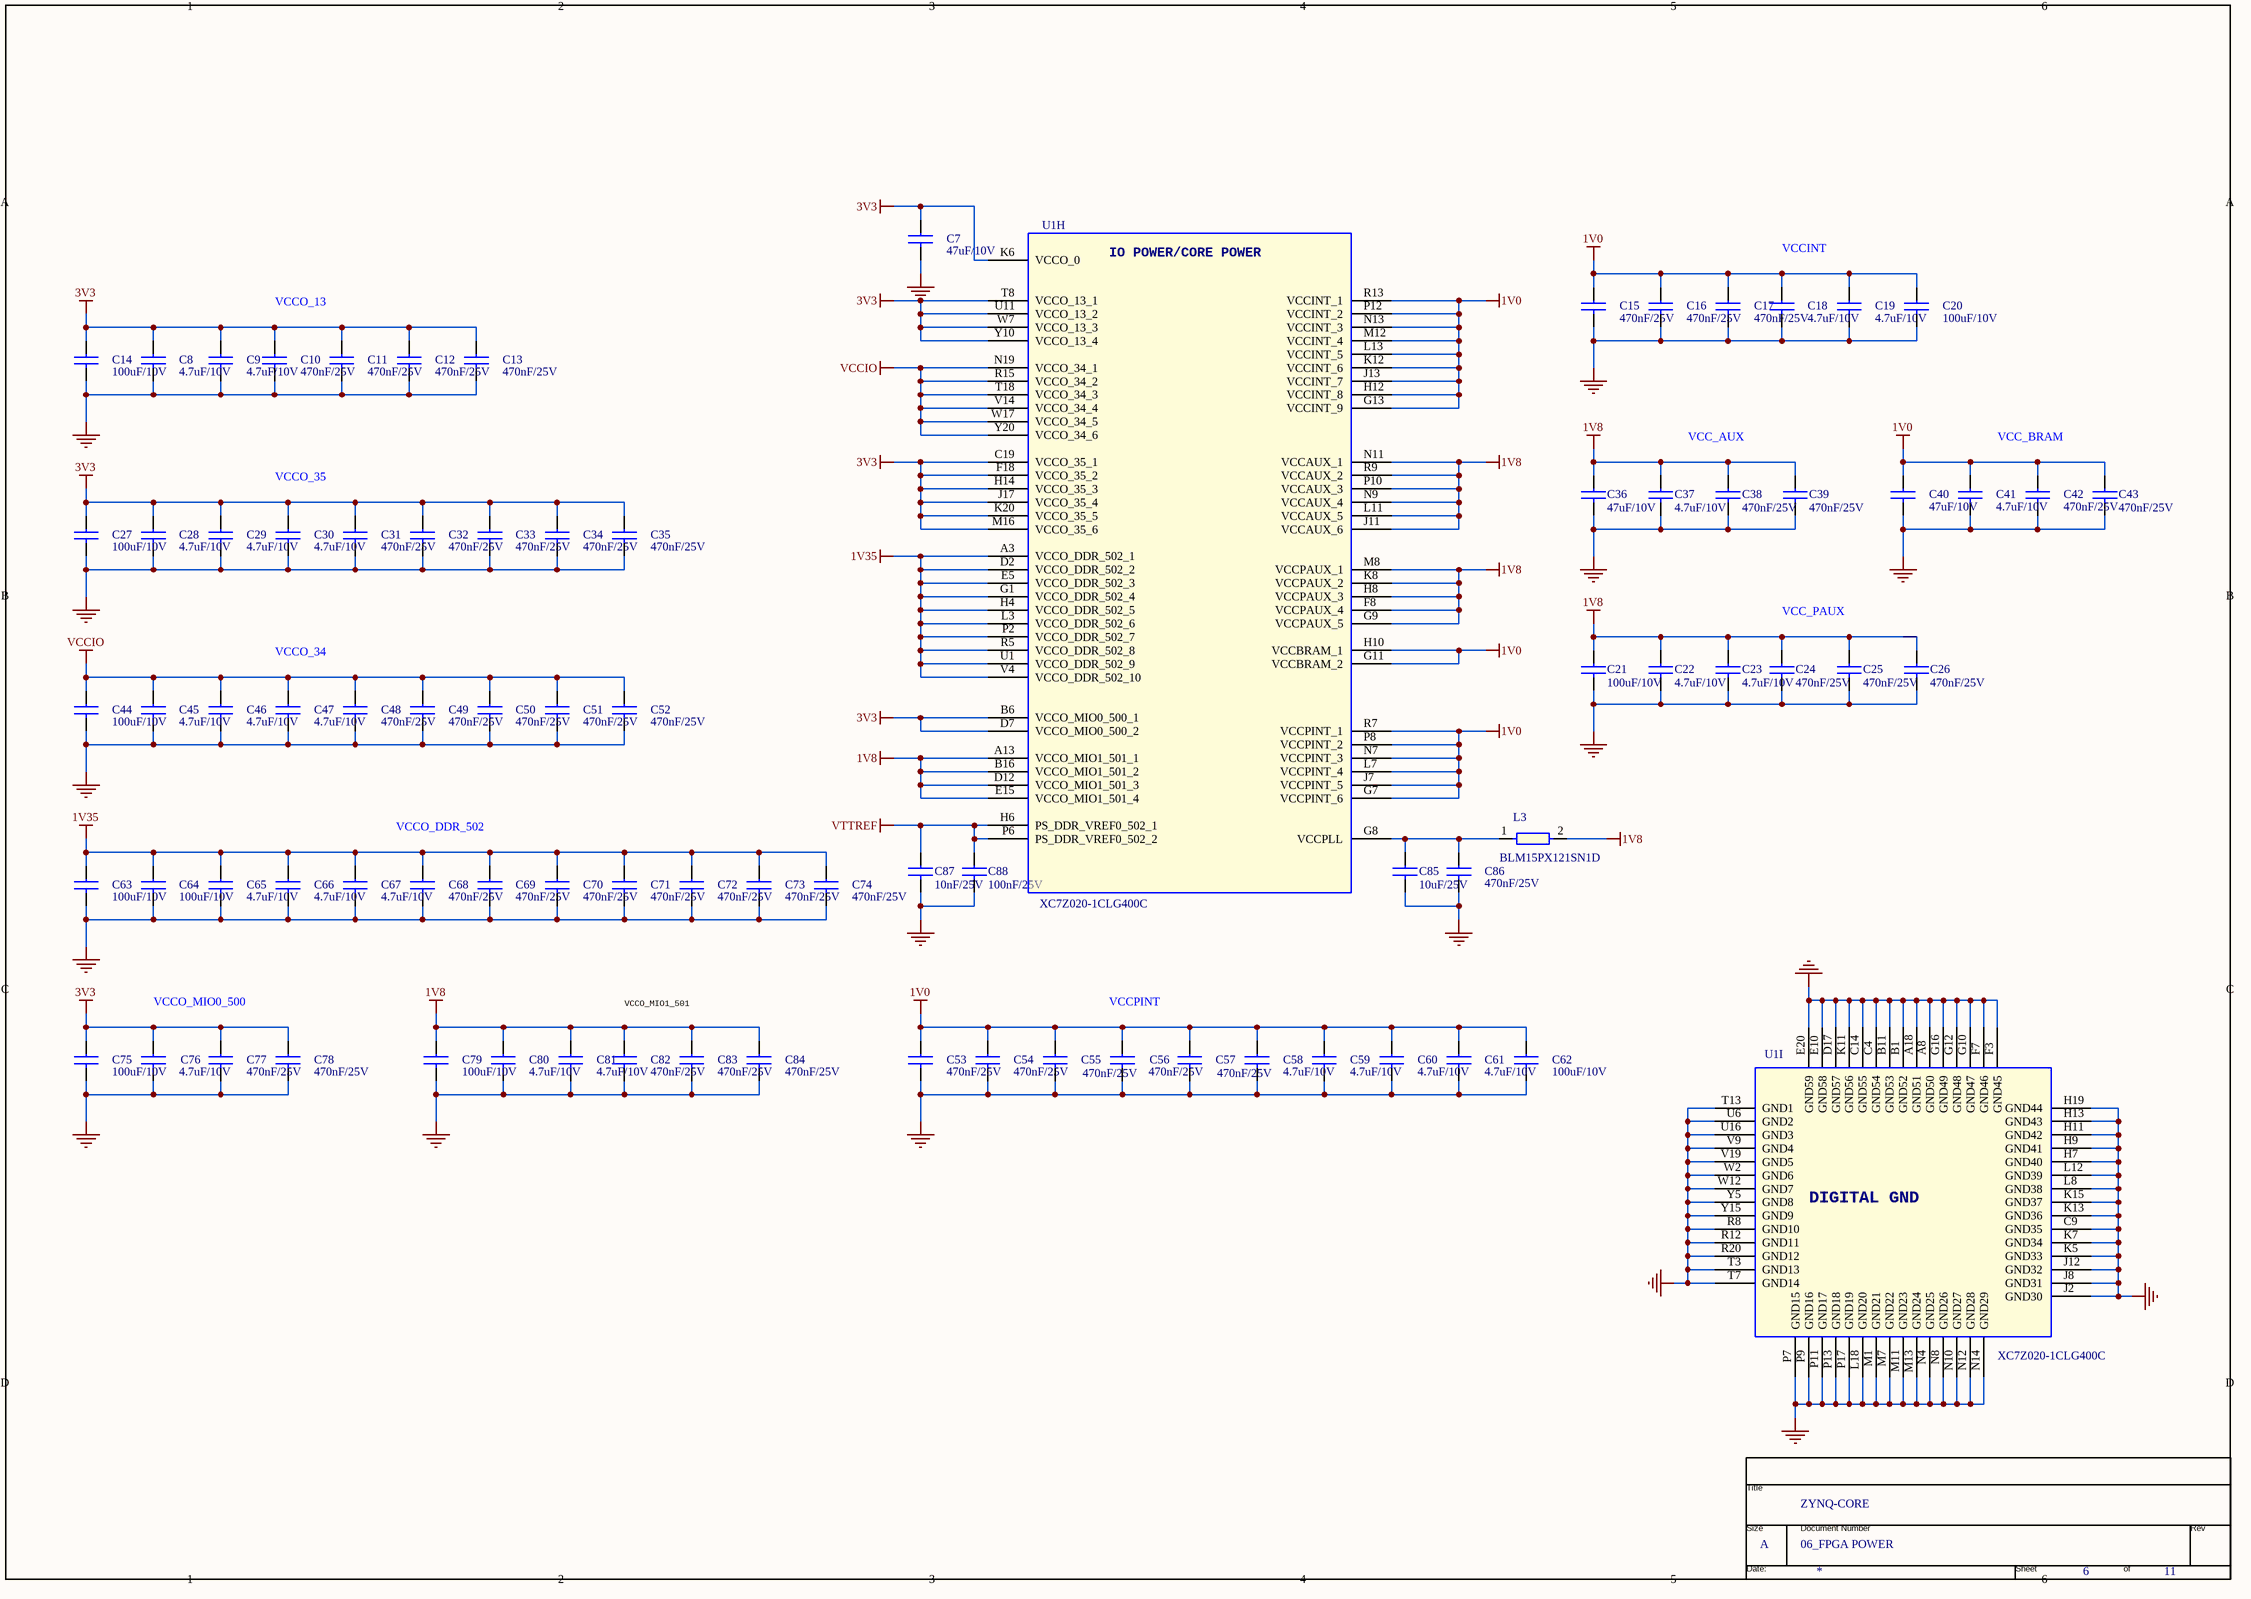
[diagram p5: 06_FPGA POWER.SchDoc]

### Parts
(Parts that share a designator on the sheet are numbered #1, #2 ... from top to bottom, then left to right.)
*#6  Page Count: 11  Page Number: 6  Page Size: A  Title: ZYNQ-CORE  Doc: 06_FPGA POWER  (hidden comment: TitleBlock0)  (graphical)
C7  47uF/10V  [C0805]
C8  4.7uF/10V  [C0402]
C9  4.7uF/10V  [C0402]
C10  470nF/25V  [C0402]
C11  470nF/25V  [C0402]
C12  470nF/25V  [C0402]
C13  470nF/25V  [C0402]
C14  100uF/10V  [1206C-N]
C15  470nF/25V  [C0402]
C16  470nF/25V  [C0402]
C17  470nF/25V  [C0402]
C18  4.7uF/10V  [C0402]
C19  4.7uF/10V  [C0402]
C20  100uF/10V  [1206C-N]
C21  100uF/10V  [1206C-N]
C22  4.7uF/10V  [C0402]
C23  4.7uF/10V  [C0402]
C24  470nF/25V  [C0402]
C25  470nF/25V  [C0402]
C26  470nF/25V  [C0402]
C27  100uF/10V  [1206C-N]
C28  4.7uF/10V  [C0402]
C29  4.7uF/10V  [C0402]
C30  4.7uF/10V  [C0402]
C31  470nF/25V  [C0402]
C32  470nF/25V  [C0402]
C33  470nF/25V  [C0402]
C34  470nF/25V  [C0402]
C35  470nF/25V  [C0402]
C36  47uF/10V  [C0805]
C37  4.7uF/10V  [C0402]
C38  470nF/25V  [C0402]
C39  470nF/25V  [C0402]
C40  47uF/10V  [C0805]
C41  4.7uF/10V  [C0402]
C42  470nF/25V  [C0402]
C43  470nF/25V  [C0402]
C44  100uF/10V  [1206C-N]
C45  4.7uF/10V  [C0402]
C46  4.7uF/10V  [C0402]
C47  4.7uF/10V  [C0402]
C48  470nF/25V  [C0402]
C49  470nF/25V  [C0402]
C50  470nF/25V  [C0402]
C51  470nF/25V  [C0402]
C52  470nF/25V  [C0402]
C53  470nF/25V  [C0402]
C54  470nF/25V  [C0402]
C55  470nF/25V  [C0402]
C56  470nF/25V  [C0402]
C57  470nF/25V  [C0402]
C58  4.7uF/10V  [C0402]
C59  4.7uF/10V  [C0402]
C60  4.7uF/10V  [C0402]
C61  4.7uF/10V  [C0402]
C62  100uF/10V  [1206C-N]
C63  100uF/10V  [1206C-N]
C64  100uF/10V  [1206C-N]
C65  4.7uF/10V  [C0402]
C66  4.7uF/10V  [C0402]
C67  4.7uF/10V  [C0402]
C68  470nF/25V  [C0402]
C69  470nF/25V  [C0402]
C70  470nF/25V  [C0402]
C71  470nF/25V  [C0402]
C72  470nF/25V  [C0402]
C73  470nF/25V  [C0402]
C74  470nF/25V  [C0402]
C75  100uF/10V  [1206C-N]
C76  4.7uF/10V  [C0402]
C77  470nF/25V  [C0402]
C78  470nF/25V  [C0402]
C79  100uF/10V  [1206C-N]
C80  4.7uF/10V  [C0402]
C81  4.7uF/10V  [C0402]
C82  470nF/25V  [C0402]
C83  470nF/25V  [C0402]
C84  470nF/25V  [C0402]
C85  10uF/25V  [C0603]
C86  470nF/25V  [C0402]
C87  10nF/25V  [C0402]
C88  100nF/25V  [C0402]
L3  BLM15PX121SN1D  [L0402]
U1  XC7Z020-1CLG400C  [CLG400]  (parts H,I of 9)

### Nets
1V0: C15.1 C16.1 C17.1 C18.1 C19.1 C20.1 C40.1 C41.1 C42.1 C43.1 C53.1 C54.1 C55.1 C56.1 C57.1 C58.1 C59.1 C60.1 C61.1 C62.1 U1.G7(VCCPINT_6) U1.G11(VCCBRAM_2) U1.G13(VCCINT_9) U1.H10(VCCBRAM_1) U1.H12(VCCINT_8) U1.J7(VCCPINT_5) U1.J13(VCCINT_7) U1.K12(VCCINT_6) U1.L7(VCCPINT_4) U1.L13(VCCINT_5) U1.M12(VCCINT_4) U1.N7(VCCPINT_3) U1.N13(VCCINT_3) U1.P8(VCCPINT_2) U1.P12(VCCINT_2) U1.R7(VCCPINT_1) U1.R13(VCCINT_1)
1V8: C21.1 C22.1 C23.1 C24.1 C25.1 C26.1 C36.1 C37.1 C38.1 C39.1 C79.1 C80.1 C81.1 C82.1 C83.1 C84.1 L3.2 U1.A13(VCCO_MIO1_501_1) U1.B16(VCCO_MIO1_501_2) U1.D12(VCCO_MIO1_501_3) U1.E15(VCCO_MIO1_501_4) U1.F8(VCCPAUX_4) U1.G9(VCCPAUX_5) U1.H8(VCCPAUX_3) U1.J11(VCCAUX_6) U1.K8(VCCPAUX_2) U1.L11(VCCAUX_5) U1.M8(VCCPAUX_1) U1.N9(VCCAUX_4) U1.N11(VCCAUX_1) U1.P10(VCCAUX_3) U1.R9(VCCAUX_2)
1V35: C63.1 C64.1 C65.1 C66.1 C67.1 C68.1 C69.1 C70.1 C71.1 C72.1 C73.1 C74.1 U1.A3(VCCO_DDR_502_1) U1.D2(VCCO_DDR_502_2) U1.E5(VCCO_DDR_502_3) U1.G1(VCCO_DDR_502_4) U1.H4(VCCO_DDR_502_5) U1.L3(VCCO_DDR_502_6) U1.P2(VCCO_DDR_502_7) U1.R5(VCCO_DDR_502_8) U1.U1(VCCO_DDR_502_9) U1.V4(VCCO_DDR_502_10)
3V3: C7.1 C8.1 C9.1 C10.1 C11.1 C12.1 C13.1 C14.1 C27.1 C28.1 C29.1 C30.1 C31.1 C32.1 C33.1 C34.1 C35.1 C75.1 C76.1 C77.1 C78.1 U1.B6(VCCO_MIO0_500_1) U1.C19(VCCO_35_1) U1.D7(VCCO_MIO0_500_2) U1.F18(VCCO_35_2) U1.H14(VCCO_35_3) U1.J17(VCCO_35_4) U1.K6(VCCO_0) U1.K20(VCCO_35_5) U1.M16(VCCO_35_6) U1.T8(VCCO_13_1) U1.U11(VCCO_13_2) U1.W7(VCCO_13_3) U1.Y10(VCCO_13_4)
GND: C7.2 C8.2 C9.2 C10.2 C11.2 C12.2 C13.2 C14.2 C15.2 C16.2 C17.2 C18.2 C19.2 C20.2 C21.2 C22.2 C23.2 C24.2 C25.2 C26.2 C27.2 C28.2 C29.2 C30.2 C31.2 C32.2 C33.2 C34.2 C35.2 C36.2 C37.2 C38.2 C39.2 C40.2 C41.2 C42.2 C43.2 C44.2 C45.2 C46.2 C47.2 C48.2 C49.2 C50.2 C51.2 C52.2 C53.2 C54.2 C55.2 C56.2 C57.2 C58.2 C59.2 C60.2 C61.2 C62.2 C63.2 C64.2 C65.2 C66.2 C67.2 C68.2 C69.2 C70.2 C71.2 C72.2 C73.2 C74.2 C75.2 C76.2 C77.2 C78.2 C79.2 C80.2 C81.2 C82.2 C83.2 C84.2 C85.2 C86.2 C87.2 C88.2 U1.A8(GND50) U1.A18(GND51) U1.B1(GND52) U1.B11(GND53) U1.C4(GND54) U1.C9(GND35) U1.C14(GND55) U1.D17(GND57) U1.E10(GND58) U1.E20(GND59) U1.F3(GND45) U1.F7(GND46) U1.G10(GND47) U1.G12(GND48) U1.G16(GND49) U1.H7(GND40) U1.H9(GND41) U1.H11(GND42) U1.H13(GND43) U1.H19(GND44) U1.J2(GND30) U1.J8(GND31) U1.J12(GND32) U1.K5(GND33) U1.K7(GND34) U1.K11(GND56) U1.K13(GND36) U1.K15(GND37) U1.L8(GND38) U1.L12(GND39) U1.L18(GND20) U1.M1(GND21) U1.M7(GND22) U1.M11(GND23) U1.M13(GND24) U1.N4(GND25) U1.N8(GND26) U1.N10(GND27) U1.N12(GND28) U1.N14(GND29) U1.P7(GND15) U1.P9(GND16) U1.P11(GND17) U1.P13(GND18) U1.P17(GND19) U1.R8(GND10) U1.R12(GND11) U1.R20(GND12) U1.T3(GND13) U1.T7(GND14) U1.T13(GND1) U1.U6(GND2) U1.U16(GND3) U1.V9(GND4) U1.V19(GND5) U1.W2(GND6) U1.W12(GND7) U1.Y5(GND8) U1.Y15(GND9)
VCCIO: C44.1 C45.1 C46.1 C47.1 C48.1 C49.1 C50.1 C51.1 C52.1 U1.N19(VCCO_34_1) U1.R15(VCCO_34_2) U1.T18(VCCO_34_3) U1.V14(VCCO_34_4) U1.W17(VCCO_34_5) U1.Y20(VCCO_34_6)
VTTREF: C87.1 C88.1 U1.H6(PS_DDR_VREF0_502_1) U1.P6(PS_DDR_VREF0_502_2)
NetC85_1: C85.1 C86.1 L3.1 U1.G8(VCCPLL)

### Notes on the sheet
- VCCINT
- VCCO_13
- VCC_AUX
- VCC_BRAM
- VCCO_35
- VCCO_34
- VCC_PAUX
- VCCO_DDR_502
- VCCO_MIO0_500
- VCCO_MIO1_501
- VCCPINT
- (in symbol TitleBlock0) Title; Size; Document Number; Rev; Date:; Sheet; of
- (in symbol Zynq7010/7020, part H) IO POWER/CORE POWER
- (in symbol Zynq7010/7020, part I) DIGITAL GND

### Library data of the parts
C7-C88 = CAP NP_Dup1
  C7 C36 C40: PCB Footprint: C0805
  C8-C13 C15-C19 C22-C26 C28-C35 C37-C39 C41-C43 C45-C61 C65-C74 C76-C78 C80-C84 C86-C88: PCB Footprint: C0402
  C14 C20 C21 C27 C44 C62-C64 C75 C79: PCB Footprint: 1206C-N
  C85: PCB Footprint: C0603
L3 = FB: 1 Description: Ferrite Bead SMD high impedance 200mA, 0.7 Ohms, 600R@100MHz; 2 Source: Murata; 4 Supply Information: MIRA 7636/17; 7 Date: 2001-04-02; PCB Footprint: L0402
U1 = Zynq7010/7020: PCB Footprint: CLG400
*#6 = TitleBlock0: Page Create Date: March  8, 1995; Page Modify Date: *

## Sheet 07_DDR3.SchDoc
size 420 x 297 mm
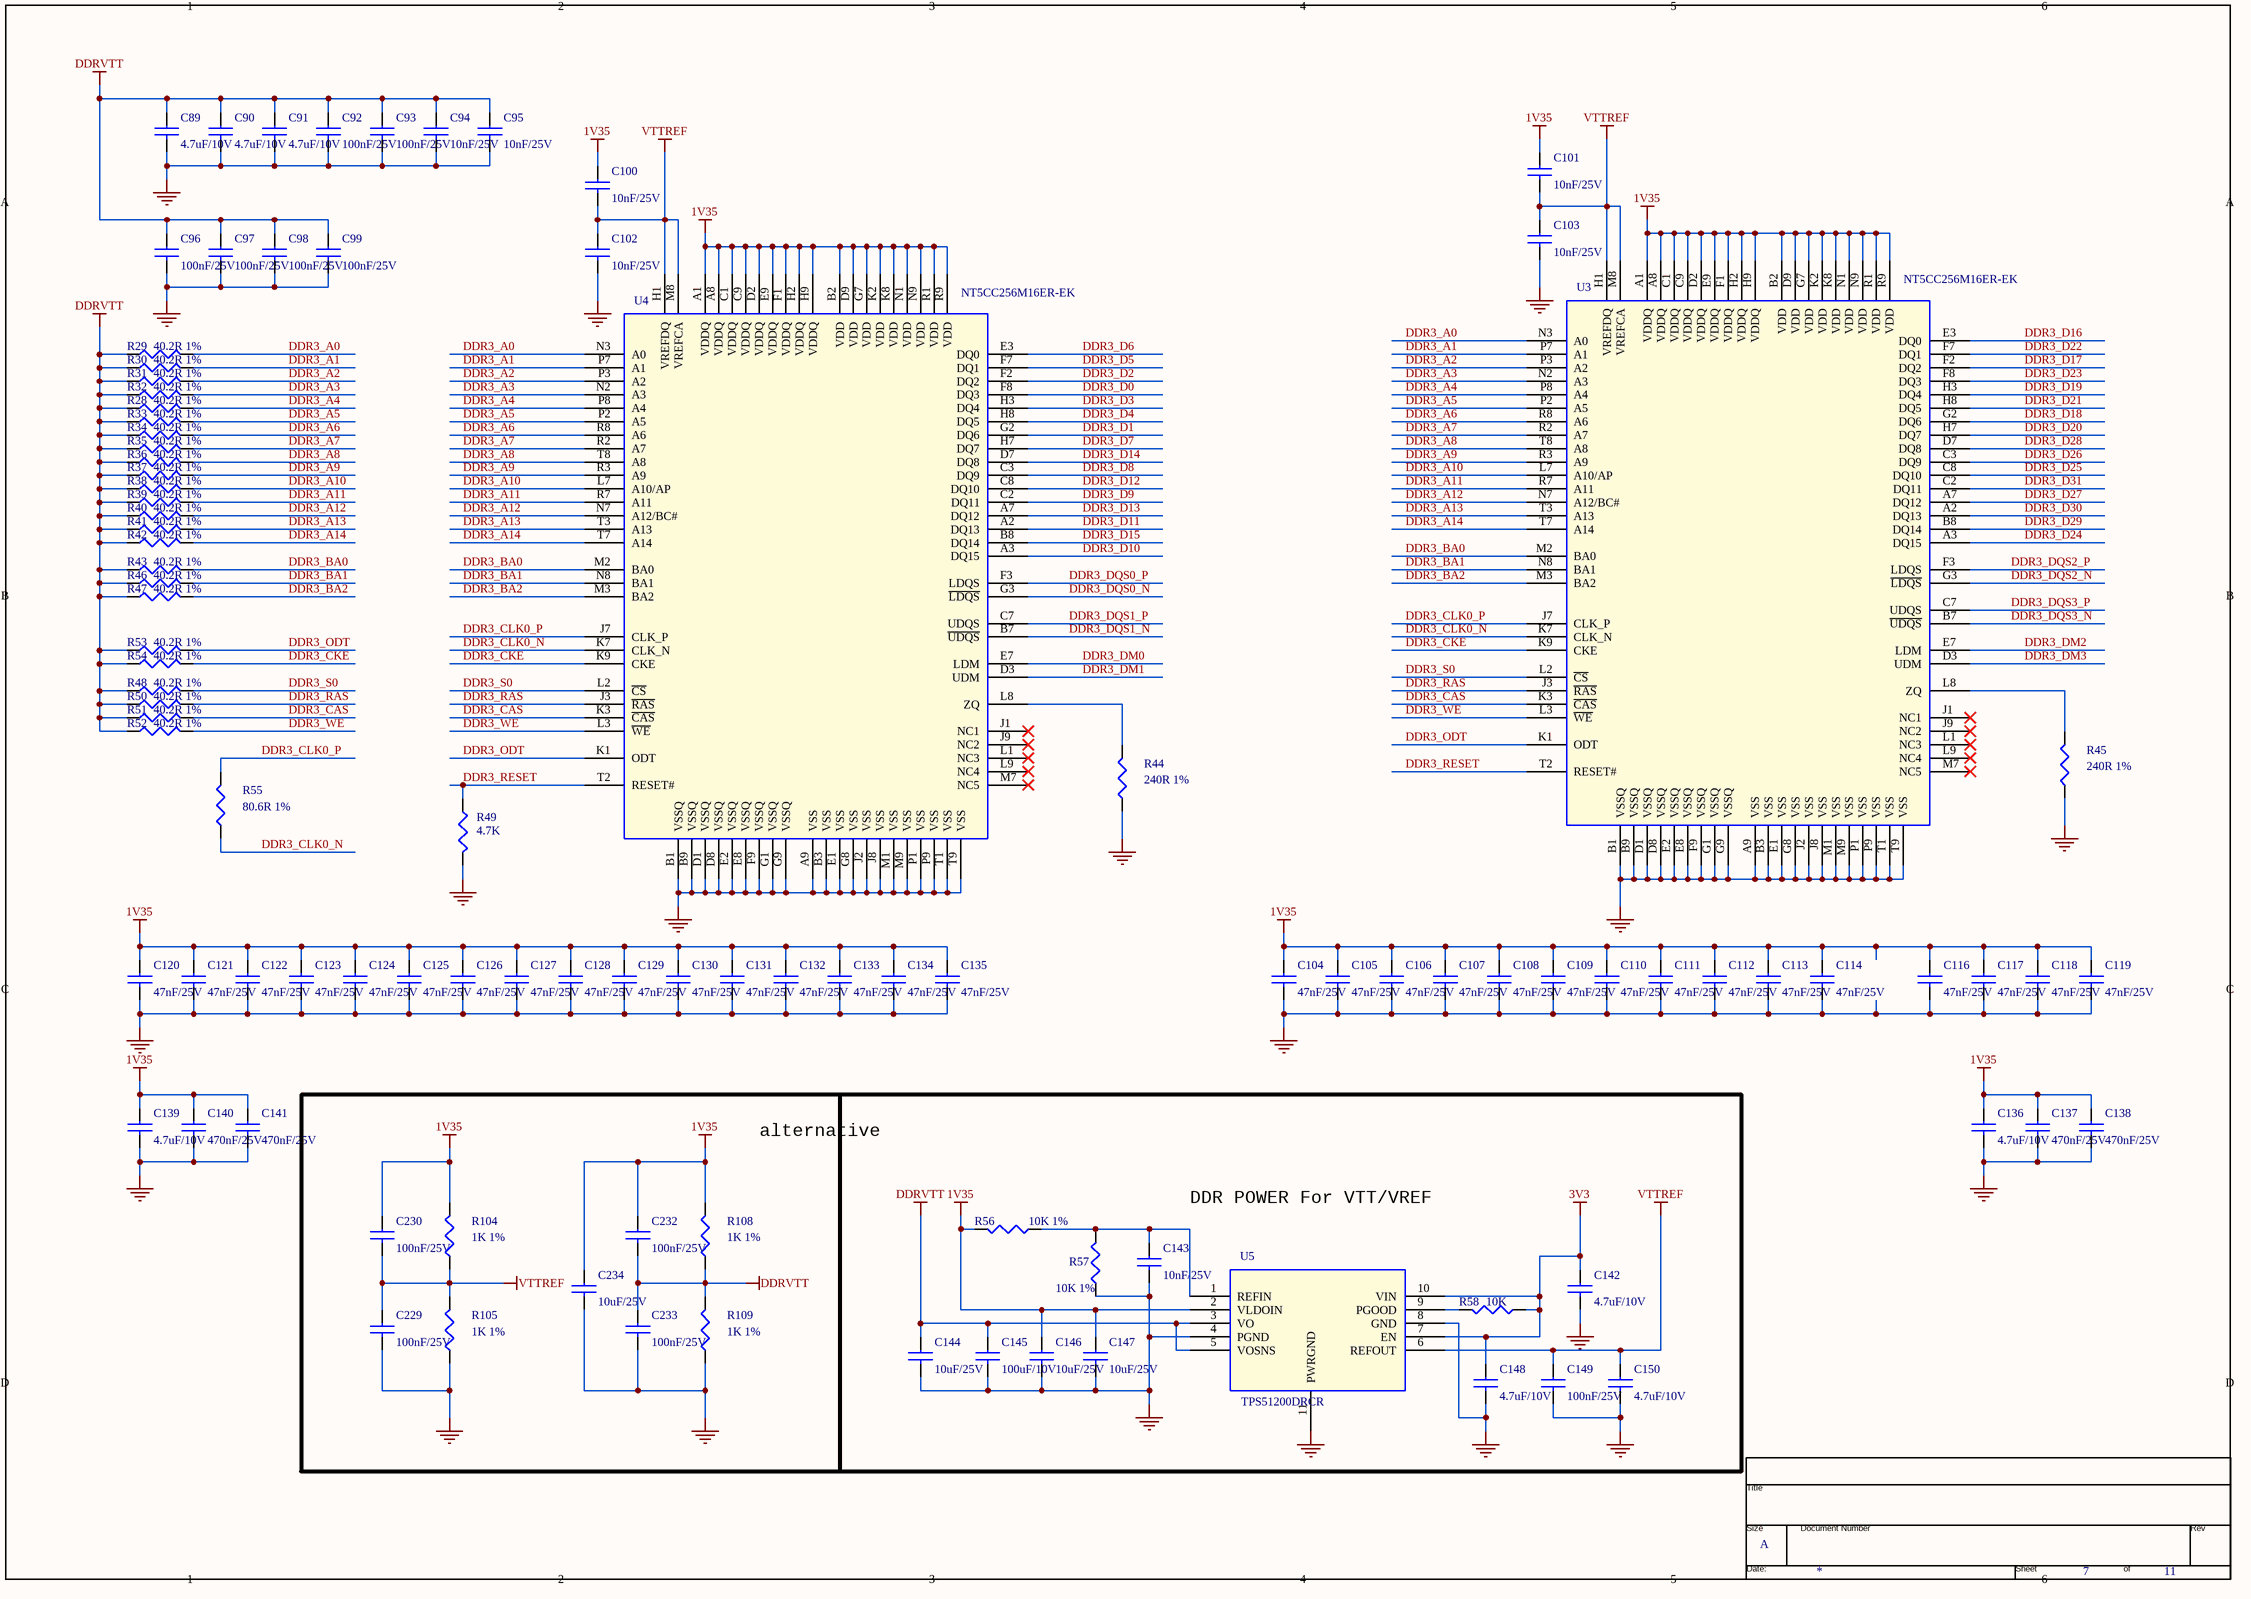
[diagram p6: 07_DDR3.SchDoc]

### Parts
(Parts that share a designator on the sheet are numbered #1, #2 ... from top to bottom, then left to right.)
*#7  Page Count: 11  Page Number: 7  Page Size: A  (hidden comment: TitleBlock0)  (graphical)
C89  4.7uF/10V  [C0402]
C90  4.7uF/10V  [C0402]
C91  4.7uF/10V  [C0402]
C92  100nF/25V  [C0402]
C93  100nF/25V  [C0402]
C94  10nF/25V  [C0402]
C95  10nF/25V  [C0402]
C96  100nF/25V  [C0402]
C97  100nF/25V  [C0402]
C98  100nF/25V  [C0402]
C99  100nF/25V  [C0402]
C100  10nF/25V  [C0402]
C101  10nF/25V  [C0402]
C102  10nF/25V  [C0402]
C103  10nF/25V  [C0402]
C104  47nF/25V  [C0402]
C105  47nF/25V  [C0402]
C106  47nF/25V  [C0402]
C107  47nF/25V  [C0402]
C108  47nF/25V  [C0402]
C109  47nF/25V  [C0402]
C110  47nF/25V  [C0402]
C111  47nF/25V  [C0402]
C112  47nF/25V  [C0402]
C113  47nF/25V  [C0402]
C114  47nF/25V  [C0402]
C116  47nF/25V  [C0402]
C117  47nF/25V  [C0402]
C118  47nF/25V  [C0402]
C119  47nF/25V  [C0402]
C120  47nF/25V  [C0402]
C121  47nF/25V  [C0402]
C122  47nF/25V  [C0402]
C123  47nF/25V  [C0402]
C124  47nF/25V  [C0402]
C125  47nF/25V  [C0402]
C126  47nF/25V  [C0402]
C127  47nF/25V  [C0402]
C128  47nF/25V  [C0402]
C129  47nF/25V  [C0402]
C130  47nF/25V  [C0402]
C131  47nF/25V  [C0402]
C132  47nF/25V  [C0402]
C133  47nF/25V  [C0402]
C134  47nF/25V  [C0402]
C135  47nF/25V  [C0402]
C136  4.7uF/10V  [C0402]
C137  470nF/25V  [C0402]
C138  470nF/25V  [C0402]
C139  4.7uF/10V  [C0402]
C140  470nF/25V  [C0402]
C141  470nF/25V  [C0402]
C142  4.7uF/10V  [C0402]
C143  10nF/25V  [C0402]
C144  10uF/25V  [C0603]
C145  100uF/10V  [1206C-N]
C146  10uF/25V  [C0603]
C147  10uF/25V  [C0603]
C148  4.7uF/10V  [C0402]
C149  100nF/25V  [C0402]
C150  4.7uF/10V  [C0402]
C229  100nF/25V  [C0402]
C230  100nF/25V  [C0402]
C232  100nF/25V  [C0402]
C233  100nF/25V  [C0402]
C234  10uF/25V  [C0603]
R28  40.2R 1%  [R0402]
R29  40.2R 1%  [R0402]
R30  40.2R 1%  [R0402]
R31  40.2R 1%  [R0402]
R32  40.2R 1%  [R0402]
R33  40.2R 1%  [R0402]
R34  40.2R 1%  [R0402]
R35  40.2R 1%  [R0402]
R36  40.2R 1%  [R0402]
R37  40.2R 1%  [R0402]
R38  40.2R 1%  [R0402]
R39  40.2R 1%  [R0402]
R40  40.2R 1%  [R0402]
R41  40.2R 1%  [R0402]
R42  40.2R 1%  [R0402]
R43  40.2R 1%  [R0402]
R44  240R 1%  [R0402]
R45  240R 1%  [R0402]
R46  40.2R 1%  [R0402]
R47  40.2R 1%  [R0402]
R48  40.2R 1%  [R0402]
R49  4.7K  [R0402]
R50  40.2R 1%  [R0402]
R51  40.2R 1%  [R0402]
R52  40.2R 1%  [R0402]
R53  40.2R 1%  [R0402]
R54  40.2R 1%  [R0402]
R55  80.6R 1%  [R0402]
R56  10K 1%  [R0402]
R57  10K 1%  [R0402]
R58  10K  [R0402]
R104  1K 1%  [R0402]
R105  1K 1%  [R0402]
R108  1K 1%  [R0603]
R109  1K 1%  [R0603]
U3  NT5CC256M16ER-EK  [FBGA_96]
U4  NT5CC256M16ER-EK  [FBGA_96]
U5  TPS51200DRCR  [TPS_QFN10]

### Nets
1V35: C100.1 C101.1 C104.1 C105.1 C106.1 C107.1 C108.1 C109.1 C110.1 C111.1 C112.1 C113.1 C114.1 C116.1 C117.1 C118.1 C119.1 C120.1 C121.1 C122.1 C123.1 C124.1 C125.1 C126.1 C127.1 C128.1 C129.1 C130.1 C131.1 C132.1 C133.1 C134.1 C135.1 C136.1 C137.1 C138.1 C139.1 C140.1 C141.1 C146.1 C147.1 C230.1 C232.1 C234.1 R56.2 R104.2 R108.2 U3.A1(VDDQ) U3.A8(VDDQ) U3.B2(VDD) U3.C1(VDDQ) U3.C9(VDDQ) U3.D2(VDDQ) U3.D9(VDD) U3.E9(VDDQ) U3.F1(VDDQ) U3.G7(VDD) U3.H2(VDDQ) U3.H9(VDDQ) U3.K2(VDD) U3.K8(VDD) U3.N1(VDD) U3.N9(VDD) U3.R1(VDD) U3.R9(VDD) U4.A1(VDDQ) U4.A8(VDDQ) U4.B2(VDD) U4.C1(VDDQ) U4.C9(VDDQ) U4.D2(VDDQ) U4.D9(VDD) U4.E9(VDDQ) U4.F1(VDDQ) U4.G7(VDD) U4.H2(VDDQ) U4.H9(VDDQ) U4.K2(VDD) U4.K8(VDD) U4.N1(VDD) U4.N9(VDD) U4.R1(VDD) U4.R9(VDD) U5.2(VLDOIN)
3V3: C142.1 C148.1 R58.1 U5.7(EN) U5.10(VIN)
DDRVTT: C89.1 C90.1 C91.1 C92.1 C93.1 C94.1 C95.1 C96.1 C97.1 C98.1 C99.1 C144.1 C145.1 C232.2 C233.1 R28.1 R29.1 R30.1 R31.1 R32.1 R33.1 R34.1 R35.1 R36.1 R37.1 R38.1 R39.1 R40.1 R41.1 R42.1 R43.1 R46.1 R47.1 R48.1 R50.1 R51.1 R52.1 R53.1 R54.1 R108.1 R109.2 U5.3(VO) U5.5(VOSNS)
GND: C89.2 C90.2 C91.2 C92.2 C93.2 C94.2 C95.2 C96.2 C97.2 C98.2 C99.2 C102.2 C103.2 C104.2 C105.2 C106.2 C107.2 C108.2 C109.2 C110.2 C111.2 C112.2 C113.2 C114.2 C116.2 C117.2 C118.2 C119.2 C120.2 C121.2 C122.2 C123.2 C124.2 C125.2 C126.2 C127.2 C128.2 C129.2 C130.2 C131.2 C132.2 C133.2 C134.2 C135.2 C136.2 C137.2 C138.2 C139.2 C140.2 C141.2 C142.2 C143.2 C144.2 C145.2 C146.2 C147.2 C148.2 C149.2 C150.2 C229.2 C233.2 C234.2 R44.1 R45.1 R49.2 R57.1 R105.1 R109.1 U3.A9(VSS) U3.B1(VSSQ) U3.B3(VSS) U3.B9(VSSQ) U3.D1(VSSQ) U3.D8(VSSQ) U3.E1(VSS) U3.E2(VSSQ) U3.E8(VSSQ) U3.F9(VSSQ) U3.G1(VSSQ) U3.G8(VSS) U3.G9(VSSQ) U3.J2(VSS) U3.J8(VSS) U3.M1(VSS) U3.M9(VSS) U3.P1(VSS) U3.P9(VSS) U3.T1(VSS) U3.T9(VSS) U4.A9(VSS) U4.B1(VSSQ) U4.B3(VSS) U4.B9(VSSQ) U4.D1(VSSQ) U4.D8(VSSQ) U4.E1(VSS) U4.E2(VSSQ) U4.E8(VSSQ) U4.F9(VSSQ) U4.G1(VSSQ) U4.G8(VSS) U4.G9(VSSQ) U4.J2(VSS) U4.J8(VSS) U4.M1(VSS) U4.M9(VSS) U4.P1(VSS) U4.P9(VSS) U4.T1(VSS) U4.T9(VSS) U5.4(PGND) U5.8(GND) U5.11(PWRGND)
VTTREF: C100.2 C101.2 C102.1 C103.1 C149.1 C150.1 C229.1 C230.2 R104.1 R105.2 U3.H1(VREFDQ) U3.M8(VREFCA) U4.H1(VREFDQ) U4.M8(VREFCA) U5.6(REFOUT)
DDR3_A0: R29.2 U3.N3(A0) U4.N3(A0)
DDR3_A1: R30.2 U3.P7(A1) U4.P7(A1)
DDR3_A2: R31.2 U3.P3(A2) U4.P3(A2)
DDR3_A3: R32.2 U3.N2(A3) U4.N2(A3)
DDR3_A4: R28.2 U3.P8(A4) U4.P8(A4)
DDR3_A5: R33.2 U3.P2(A5) U4.P2(A5)
DDR3_A6: R34.2 U3.R8(A6) U4.R8(A6)
DDR3_A7: R35.2 U3.R2(A7) U4.R2(A7)
DDR3_A8: R36.2 U3.T8(A8) U4.T8(A8)
DDR3_A9: R37.2 U3.R3(A9) U4.R3(A9)
DDR3_A10: R38.2 U3.L7(A10/AP) U4.L7(A10/AP)
DDR3_A11: R39.2 U3.R7(A11) U4.R7(A11)
DDR3_A12: R40.2 U3.N7(A12/BC#) U4.N7(A12/BC#)
DDR3_A13: R41.2 U3.T3(A13) U4.T3(A13)
DDR3_A14: R42.2 U3.T7(A14) U4.T7(A14)
DDR3_BA0: R43.2 U3.M2(BA0) U4.M2(BA0)
DDR3_BA1: R46.2 U3.N8(BA1) U4.N8(BA1)
DDR3_BA2: R47.2 U3.M3(BA2) U4.M3(BA2)
DDR3_CAS: R51.2 U3.K3(~{CAS}) U4.K3(~{CAS})
DDR3_CKE: R54.2 U3.K9(CKE) U4.K9(CKE)
DDR3_CLK0_N: R55.1 U3.K7(CLK_N) U4.K7(CLK_N)
DDR3_CLK0_P: R55.2 U3.J7(CLK_P) U4.J7(CLK_P)
DDR3_D0: U4.F8(DQ3)
DDR3_D1: U4.G2(DQ6)
DDR3_D2: U4.F2(DQ2)
DDR3_D3: U4.H3(DQ4)
DDR3_D4: U4.H8(DQ5)
DDR3_D5: U4.F7(DQ1)
DDR3_D6: U4.E3(DQ0)
DDR3_D7: U4.H7(DQ7)
DDR3_D8: U4.C3(DQ9)
DDR3_D9: U4.C2(DQ11)
DDR3_D10: U4.A3(DQ15)
DDR3_D11: U4.A2(DQ13)
DDR3_D12: U4.C8(DQ10)
DDR3_D13: U4.A7(DQ12)
DDR3_D14: U4.D7(DQ8)
DDR3_D15: U4.B8(DQ14)
DDR3_D16: U3.E3(DQ0)
DDR3_D17: U3.F2(DQ2)
DDR3_D18: U3.G2(DQ6)
DDR3_D19: U3.H3(DQ4)
DDR3_D20: U3.H7(DQ7)
DDR3_D21: U3.H8(DQ5)
DDR3_D22: U3.F7(DQ1)
DDR3_D23: U3.F8(DQ3)
DDR3_D24: U3.A3(DQ15)
DDR3_D25: U3.C8(DQ10)
DDR3_D26: U3.C3(DQ9)
DDR3_D27: U3.A7(DQ12)
DDR3_D28: U3.D7(DQ8)
DDR3_D29: U3.B8(DQ14)
DDR3_D30: U3.A2(DQ13)
DDR3_D31: U3.C2(DQ11)
DDR3_DM0: U4.E7(LDM)
DDR3_DM1: U4.D3(UDM)
DDR3_DM2: U3.E7(LDM)
DDR3_DM3: U3.D3(UDM)
DDR3_DQS0_N: U4.G3(~{LDQS})
DDR3_DQS0_P: U4.F3(LDQS)
DDR3_DQS1_N: U4.B7(~{UDQS})
DDR3_DQS1_P: U4.C7(UDQS)
DDR3_DQS2_N: U3.G3(~{LDQS})
DDR3_DQS2_P: U3.F3(LDQS)
DDR3_DQS3_N: U3.B7(~{UDQS})
DDR3_DQS3_P: U3.C7(UDQS)
DDR3_ODT: R53.2 U3.K1(ODT) U4.K1(ODT)
DDR3_RAS: R50.2 U3.J3(~{RAS}) U4.J3(~{RAS})
DDR3_RESET: R49.1 U3.T2(RESET#) U4.T2(RESET#)
DDR3_S0: R48.2 U3.L2(~{CS}) U4.L2(~{CS})
DDR3_WE: R52.2 U3.L3(~{WE}) U4.L3(~{WE})
NetC143_1: C143.1 R56.1 R57.2 U5.1(REFIN)
NetR44_2: R44.2 U4.L8(ZQ)
NetR45_2: R45.2 U3.L8(ZQ)
NetR58_2: R58.2 U5.9(PGOOD)

Not connected (* = marked no-connect by the designer): U3 J1(NC1)* J9(NC2)* L1(NC3)* L9(NC4)* M7(NC5)*; U4 J1(NC1)* J9(NC2)* L1(NC3)* L9(NC4)* M7(NC5)*

### Notes on the sheet
- alternative
- DDR POWER For VTT/VREF
- (in symbol TitleBlock0) Title; Size; Document Number; Rev; Date:; Sheet; of

### Library data of the parts
C89-C114 C116-C150 C229 C230 C232-C234 = CAP NP_Dup1
  C89-C114 C116-C143 C148-C150 C229 C230 C232 C233: PCB Footprint: C0402
  C144 C146 C147 C234: PCB Footprint: C0603
  C145: PCB Footprint: 1206C-N
R28-R58 R104 R105 = RESISTOR_Dup1: PCB Footprint: R0402
R108 R109 = RESISTOR_Dup1: 0603; PCB Footprint: R0603
U3 U4 = H5TQ4G63AFR-PBI: PCB Footprint: FBGA_96
*#7 = TitleBlock0: Page Create Date: March  8, 1995; Page Modify Date: *
U5 = TPS51200DRCR: PCB Footprint: TPS_QFN10

## Sheet 08_eMMC.SchDoc
size 297 x 209 mm
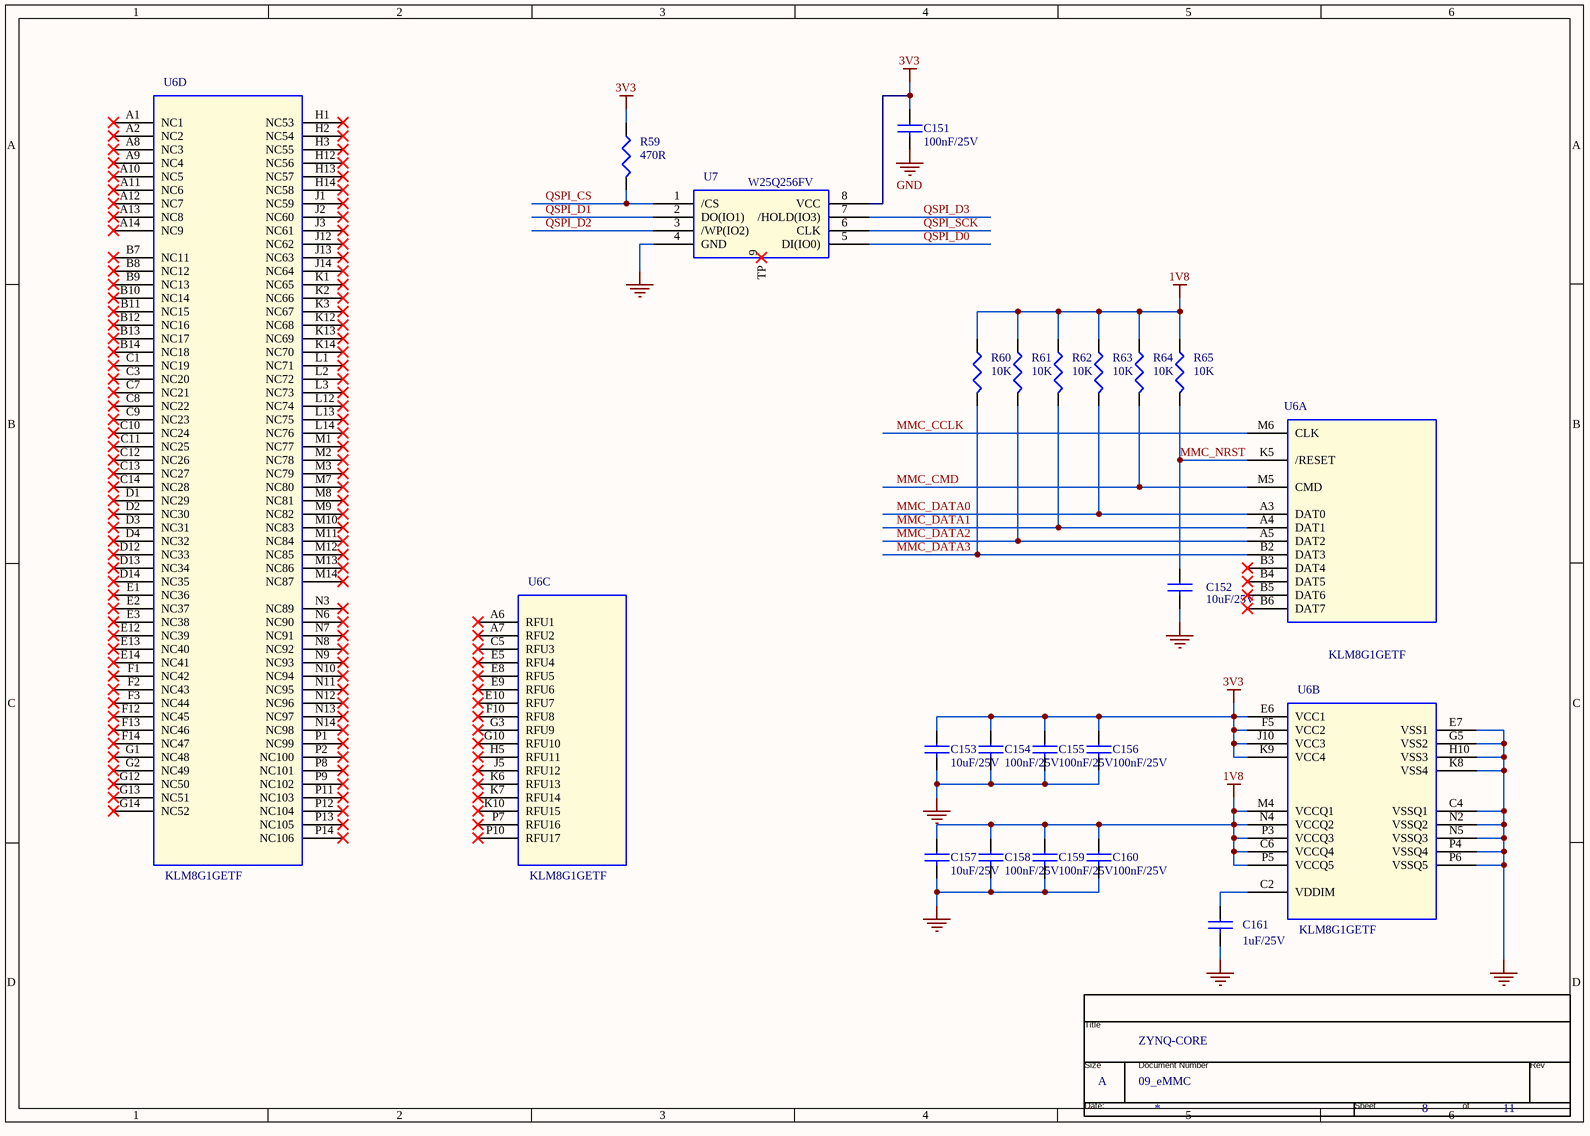
[diagram p7: 08_eMMC.SchDoc]

### Parts
(Parts that share a designator on the sheet are numbered #1, #2 ... from top to bottom, then left to right.)
*#8  Page Count: 11  Page Number: 8  Page Size: A  Title: ZYNQ-CORE  Doc: 09_eMMC  (hidden comment: TitleBlock0)  (graphical)
C151  100nF/25V  [C0402]
C152  10uF/25V  [C0603]
C153  10uF/25V  [C0603]
C154  100nF/25V  [C0402]
C155  100nF/25V  [C0402]
C156  100nF/25V  [C0402]
C157  10uF/25V  [C0603]
C158  100nF/25V  [C0402]
C159  100nF/25V  [C0402]
C160  100nF/25V  [C0402]
C161  1uF/25V  [C0402]
R59  470R  [R0402]
R60  10K  [R0402]
R61  10K  [R0402]
R62  10K  [R0402]
R63  10K  [R0402]
R64  10K  [R0402]
R65  10K  [R0402]
U6  KLM8G1GETF  [VFBGA]  (parts A,B,C,D of 4)
U7  W25Q256FV  [MLP8]

### Nets
1V8: C157.1 C158.1 C159.1 C160.1 R60.1 R61.1 R62.1 R63.1 R64.1 R65.1 U6.C6(VCCQ4) U6.M4(VCCQ1) U6.N4(VCCQ2) U6.P3(VCCQ3) U6.P5(VCCQ5)
3V3: C151.1 C153.1 C154.1 C155.1 C156.1 R59.1 U6.E6(VCC1) U6.F5(VCC2) U6.J10(VCC3) U6.K9(VCC4) U7.8(VCC)
GND: C151.2 C152.2 C153.2 C154.2 C155.2 C156.2 C157.2 C158.2 C159.2 C160.2 C161.2 U6.C4(VSSQ1) U6.E7(VSS1) U6.G5(VSS2) U6.H10(VSS3) U6.K8(VSS4) U6.N2(VSSQ2) U6.N5(VSSQ3) U6.P4(VSSQ4) U6.P6(VSSQ5) U7.4(GND)
MMC_CCLK: U6.M6(CLK)
MMC_CMD: R64.2 U6.M5(CMD)
MMC_DATA0: R63.2 U6.A3(DAT0)
MMC_DATA1: R62.2 U6.A4(DAT1)
MMC_DATA2: R61.2 U6.A5(DAT2)
MMC_DATA3: R60.2 U6.B2(DAT3)
MMC_NRST: C152.1 R65.2 U6.K5(/RESET)
QSPI_CS: R59.2 U7.1(/CS)
QSPI_D0: U7.5(DI(IO0))
QSPI_D1: U7.2(DO(IO1))
QSPI_D2: U7.3(/WP(IO2))
QSPI_D3: U7.7(/HOLD(IO3))
QSPI_SCK: U7.6(CLK)
NetC161_1: C161.1 U6.C2(VDDIM)

Not connected (* = marked no-connect by the designer): U6 A1(NC1)* A2(NC2)* A6(RFU1)* A7(RFU2)* A8(NC3)* A9(NC4)* A10(NC5)* A11(NC6)* A12(NC7)* A13(NC8)* A14(NC9)* B3(DAT4)* B4(DAT5)* B5(DAT6)* B6(DAT7)* B7(NC11)* B8(NC12)* B9(NC13)* B10(NC14)* B11(NC15)* B12(NC16)* B13(NC17)* B14(NC18)* C1(NC19)* C3(NC20)* C5(RFU3)* C7(NC21)* C8(NC22)* C9(NC23)* C10(NC24)* C11(NC25)* C12(NC26)* C13(NC27)* C14(NC28)* D1(NC29)* D2(NC30)* D3(NC31)* D4(NC32)* D12(NC33)* D13(NC34)* D14(NC35)* E1(NC36)* E2(NC37)* E3(NC38)* E5(RFU4)* E8(RFU5)* E9(RFU6)* E10(RFU7)* E12(NC39)* E13(NC40)* E14(NC41)* F1(NC42)* F2(NC43)* F3(NC44)* F10(RFU8)* F12(NC45)* F13(NC46)* F14(NC47)* G1(NC48)* G2(NC49)* G3(RFU9)* G10(RFU10)* G12(NC50)* G13(NC51)* G14(NC52)* H1(NC53)* H2(NC54)* H3(NC55)* H5(RFU11)* H12(NC56)* H13(NC57)* H14(NC58)* J1(NC59)* J2(NC60)* J3(NC61)* J5(RFU12)* J12(NC62)* J13(NC63)* J14(NC64)* K1(NC65)* K2(NC66)* K3(NC67)* K6(RFU13)* K7(RFU14)* K10(RFU15)* K12(NC68)* K13(NC69)* K14(NC70)* L1(NC71)* L2(NC72)* L3(NC73)* L12(NC74)* L13(NC75)* L14(NC76)* M1(NC77)* M2(NC78)* M3(NC79)* M7(NC80)* M8(NC81)* M9(NC82)* M10(NC83)* M11(NC84)* M12(NC85)* M13(NC86)* M14(NC87)* N3(NC89)* N6(NC90)* N7(NC91)* N8(NC92)* N9(NC93)* N10(NC94)* N11(NC95)* N12(NC96)* N13(NC97)* N14(NC98)* P1(NC99)* P2(NC100)* P7(RFU16)* P8(NC101)* P9(NC102)* P10(RFU17)* P11(NC103)* P12(NC104)* P13(NC105)* P14(NC106)*; U7 9(TP)*

### Notes on the sheet
- (in symbol TitleBlock0) Title; Size; Document Number; Rev; Date:; Sheet; of

### Library data of the parts
C151-C160 = CAP NP
  C151 C154-C156 C158-C160: PCB Footprint: C0402
  C152 C153 C157: PCB Footprint: C0603
C161 = CAP NP: PCB Footprint: C0603
R59-R65 = RESISTOR: PCB Footprint: R0402
U6 = MTFC4GACAAAM-1M_2: PCB Footprint: VFBGA
*#8 = TitleBlock0: Page Create Date: March  8, 1995; Page Modify Date: *
U7 = W25Q256FV: PCB Footprint: MLP8

## Sheet 09_POWER.SchDoc
size 297 x 209 mm
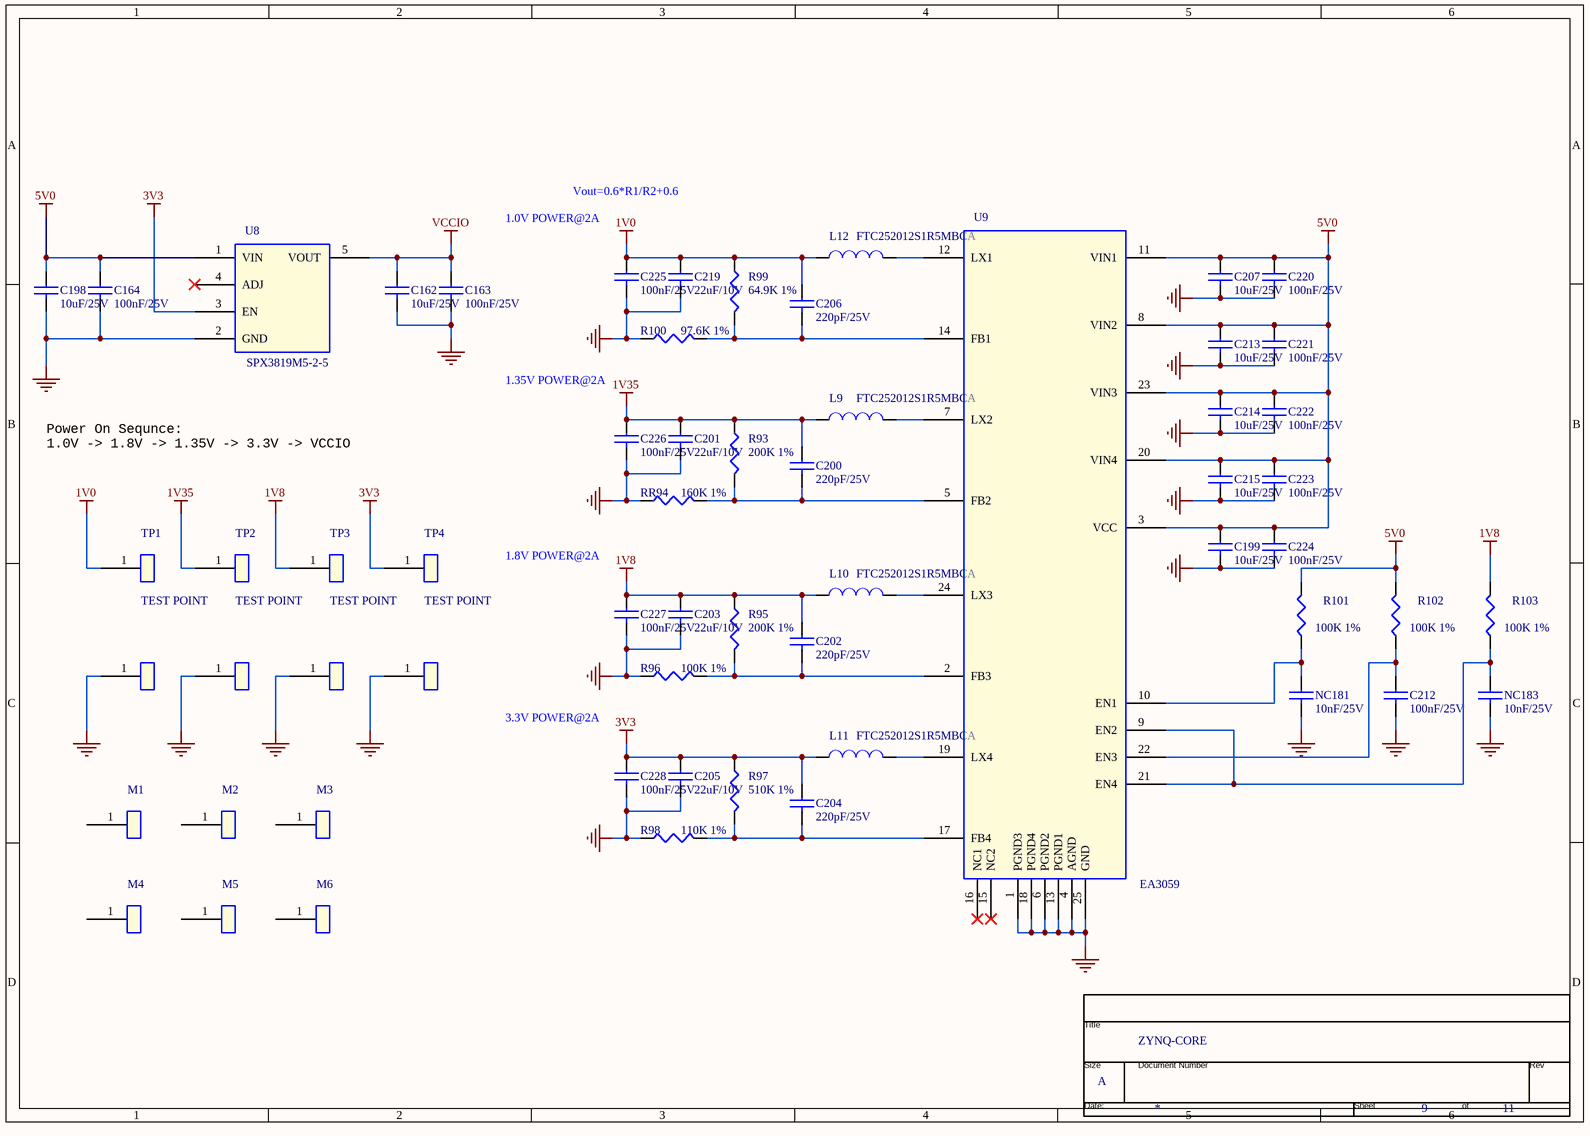
[diagram p8: 09_POWER.SchDoc]

### Parts
(Parts that share a designator on the sheet are numbered #1, #2 ... from top to bottom, then left to right.)
*#9  Page Count: 11  Page Number: 9  Page Size: A  Title: ZYNQ-CORE  (hidden comment: TitleBlock0)  (graphical)
C162  10uF/25V  [C0603]
C163  100nF/25V  [C0402]
C164  100nF/25V  [C0402]
C198  10uF/25V  [C0603]
C199  10uF/25V  [C0603]
C200  220pF/25V  [C0402]
C201  22uF/10V  [C0603]
C202  220pF/25V  [C0402]
C203  22uF/10V  [C0603]
C204  220pF/25V  [C0402]
C205  22uF/10V  [C0603]
C206  220pF/25V  [C0402]
C207  10uF/25V  [C0603]
C212  100nF/25V  [C0603]
C213  10uF/25V  [C0603]
C214  10uF/25V  [C0603]
C215  10uF/25V  [C0603]
C219  22uF/10V  [C0603]
C220  100nF/25V  [C0402]
C221  100nF/25V  [C0402]
C222  100nF/25V  [C0402]
C223  100nF/25V  [C0402]
C224  100nF/25V  [C0402]
C225  100nF/25V  [C0402]
C226  100nF/25V  [C0402]
C227  100nF/25V  [C0402]
C228  100nF/25V  [C0402]
H1  H1  [HOLE3_8D2_6MM]  (value not drawn)
H2  H2  [HOLE3_8D2_6MM]  (value not drawn)
H3  H3  [HOLE3_8D2_6MM]  (value not drawn)
H4  H4  [HOLE3_8D2_6MM]  (value not drawn)
L9  FTC252012S1R5MBCA  [2520]
L10  FTC252012S1R5MBCA  [2520]
L11  FTC252012S1R5MBCA  [2520]
L12  FTC252012S1R5MBCA  [2520]
M1  MARK  [Mark]  (value not drawn)
M2  MARK  [Mark]  (value not drawn)
M3  MARK  [Mark]  (value not drawn)
M4  MARK  [Mark]  (value not drawn)
M5  MARK  [Mark]  (value not drawn)
M6  MARK  [Mark]  (value not drawn)
NC181  10nF/25V  [C0603]
NC183  10nF/25V  [C0603]
R93  200K 1%  [R0402]
R95  200K 1%  [R0402]
R96  100K 1%  [R0402]
R97  510K 1%  [R0402]
R98  110K 1%  [R0402]
R99  64.9K 1%  [R0402]
R100  97.6K 1%  [R0402]
R101  100K 1%  [R0402]
R102  100K 1%  [R0402]
R103  100K 1%  [R0402]
RR94  160K 1%  [R0402]
TP1  TEST POINT  [FPAD_1]
TP2  TEST POINT  [FPAD_1]
TP3  TEST POINT  [FPAD_1]
TP4  TEST POINT  [FPAD_1]
U8  SPX3819M5-2-5  [SOT-23-5]
U9  EA3059  [QFN24_RTW]

### Nets
1V0: C206.1 C219.1 C225.1 L12.1 R99.1 TP1.1
1V8: C202.1 C203.1 C227.1 L10.1 R95.1 R103.2 TP3.1
1V35: C200.1 C201.1 C226.1 L9.1 R93.1 TP2.1
3V3: C204.1 C205.1 C228.1 L11.1 R97.1 TP4.1 U8.3(EN)
5V0: C164.1 C198.1 C199.1 C207.1 C213.1 C214.1 C215.1 C220.1 C221.1 C222.1 C223.1 C224.1 R101.2 R102.2 U8.1(VIN) U9.3(VCC) U9.8(VIN2) U9.11(VIN1) U9.20(VIN4) U9.23(VIN3)
GND: C162.2 C163.2 C164.2 C198.2 C199.2 C201.2 C203.2 C205.2 C207.2 C212.2 C213.2 C214.2 C215.2 C219.2 C220.2 C221.2 C222.2 C223.2 C224.2 C225.2 C226.2 C227.2 C228.2 H1.1 H2.1 H3.1 H4.1 NC181.2 NC183.2 R96.1 R98.1 R100.1 RR94.1 U8.2(GND) U9.1(PGND3) U9.4(AGND) U9.6(PGND2) U9.13(PGND1) U9.18(PGND4) U9.25(GND)
VCCIO: C162.1 C163.1 U8.5(VOUT)
NetC200_2: C200.2 R93.2 RR94.2 U9.5(FB2)
NetC202_2: C202.2 R95.2 R96.2 U9.2(FB3)
NetC204_2: C204.2 R97.2 R98.2 U9.17(FB4)
NetC206_2: C206.2 R99.2 R100.2 U9.14(FB1)
NetC212_1: C212.1 R102.1 U9.22(EN3)
NetL9_2: L9.2 U9.7(LX2)
NetL10_2: L10.2 U9.24(LX3)
NetL11_2: L11.2 U9.19(LX4)
NetL12_2: L12.2 U9.12(LX1)
NetNC181_1: NC181.1 R101.1 U9.10(EN1)
NetNC183_1: NC183.1 R103.1 U9.9(EN2) U9.21(EN4)

Not connected (* = marked no-connect by the designer): M1 1; M2 1; M3 1; M4 1; M5 1; M6 1; U8 4(ADJ)*; U9 15(NC2)* 16(NC1)*

### Notes on the sheet
- Vout=0.6*R1/R2+0.6
- 1.0V POWER@2A
- 1.35V POWER@2A
- Power On Sequnce:
  1.0V -> 1.8V -> 1.35V -> 3.3V -> VCCIO
- 1.8V POWER@2A
- 3.3V POWER@2A
- (in symbol TitleBlock0) Title; Size; Document Number; Rev; Date:; Sheet; of

### Library data of the parts
C162-C164 C198-C207 C213-C215 C219-C228 = CAP NP
  C162 C198 C199 C201 C203 C205 C207 C213-C215 C219: PCB Footprint: C0603
  C163 C164 C200 C202 C204 C206 C220-C228: PCB Footprint: C0402
C212 = CAP NP: 0603; PCB Footprint: C0402
H1-H4 = TEST POINT: PCB Footprint: HOLE3_8D2_6MM
L9-L12 = INDUCTOR: 1.5uH; PCB Footprint: 2520
M1-M6 = TEST POINT: PCB Footprint: FPAD_1
NC181 NC183 = CAP NP: PCB Footprint: C0402
R93 R95-R103 RR94 = RESISTOR: PCB Footprint: R0402
*#9 = TitleBlock0: Page Create Date: March  8, 1995; Page Modify Date: *
TP1-TP4 = TEST POINT: PCB Footprint: FPAD_1
U8 = SPX3819M5-2-5: PCB Footprint: SOT-23-5
U9 = EA3059: PCB Footprint: QFN24_RTW

## Sheet 10_Ethernet-YT8521SC_CA.SchDoc
size 297 x 209 mm
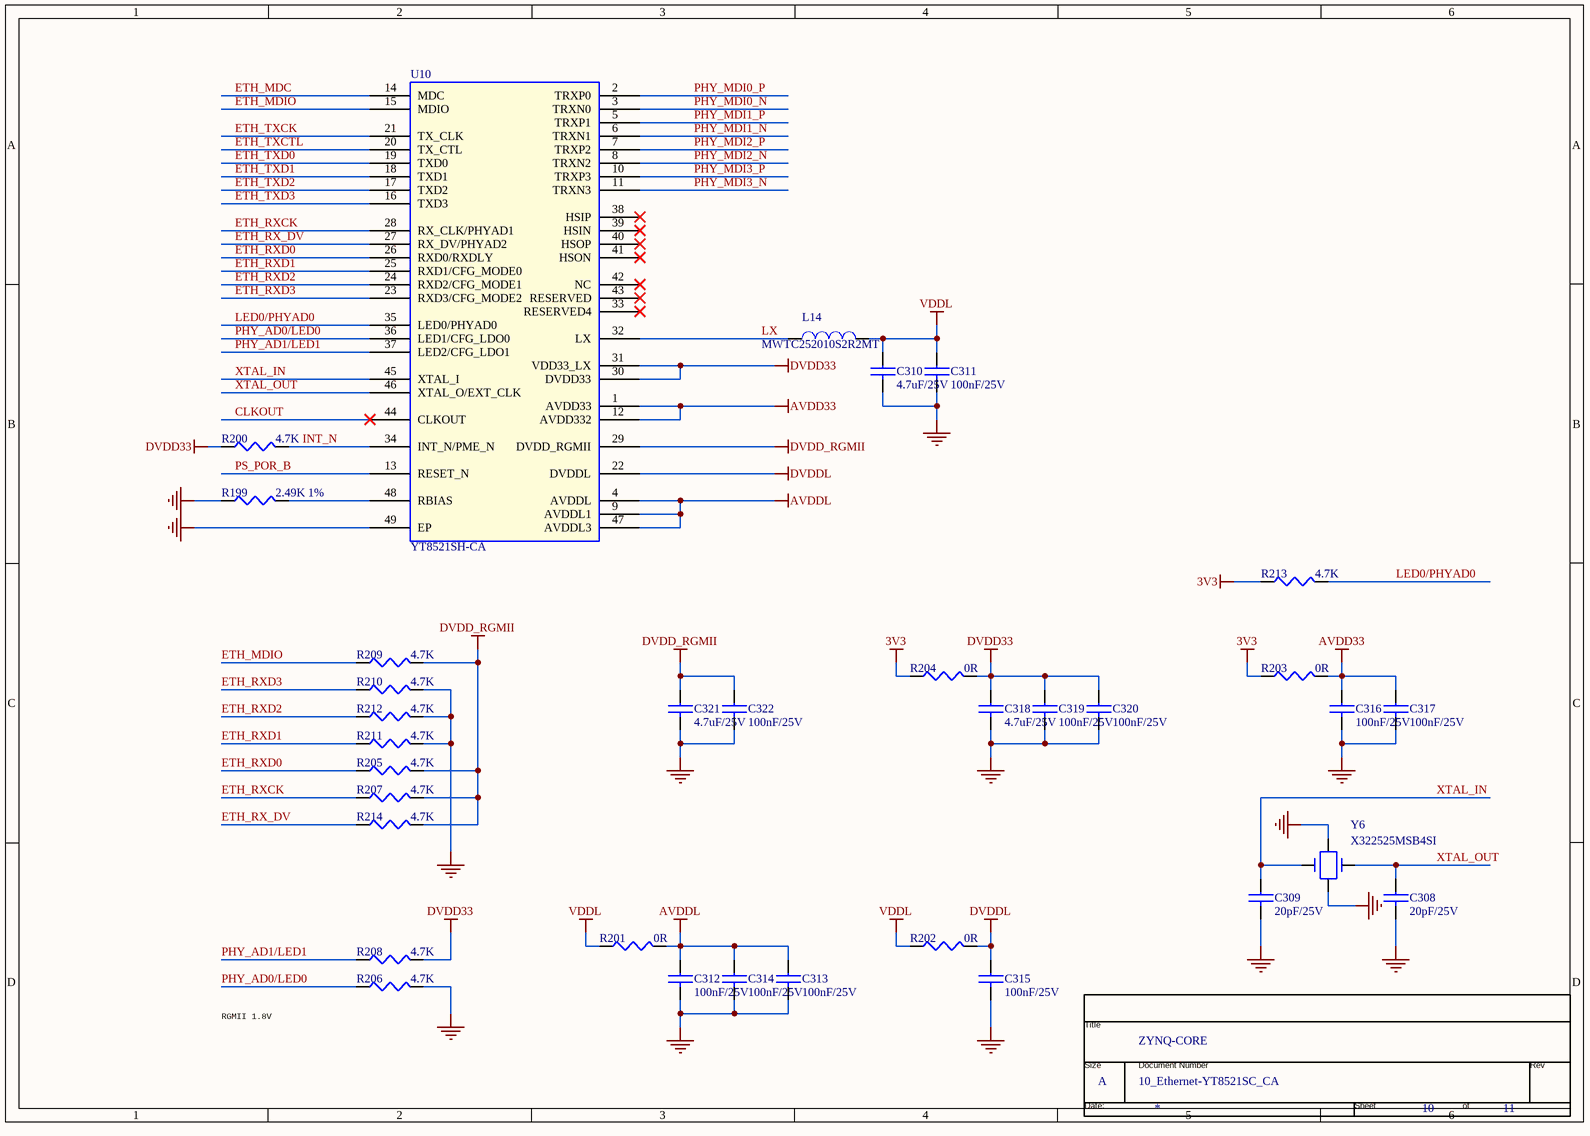
[diagram p9: 10_Ethernet-YT8521SC_CA.SchDoc]

### Parts
(Parts that share a designator on the sheet are numbered #1, #2 ... from top to bottom, then left to right.)
*#10  Page Count: 11  Page Number: 10  Page Size: A  Title: ZYNQ-CORE  Doc: 10_Ethernet-YT8521SC_CA  (hidden comment: TitleBlock0)  (graphical)
C308  20pF/25V  [C0402]
C309  20pF/25V  [C0402]
C310  4.7uF/25V  [C0603]
C311  100nF/25V  [C0402]
C312  100nF/25V  [C0402]
C313  100nF/25V  [C0402]
C314  100nF/25V  [C0402]
C315  100nF/25V  [C0402]
C316  100nF/25V  [C0402]
C317  100nF/25V  [C0402]
C318  4.7uF/25V  [C0603]
C319  100nF/25V  [C0402]
C320  100nF/25V  [C0402]
C321  4.7uF/25V  [C0603]
C322  100nF/25V  [C0402]
L14  MWTC252010S2R2MT  [2520]
R199  2.49K 1%  [R0402]
R200  4.7K  [R0402]
R201  0R  [R0402]
R202  0R  [R0402]
R203  0R  [R0402]
R204  0R  [R0402]
R205  4.7K  [R0402]
R206  4.7K  [R0402]
R207  4.7K  [R0402]
R208  4.7K  [R0402]
R209  4.7K  [R0402]
R210  4.7K  [R0402]
R211  4.7K  [R0402]
R212  4.7K  [R0402]
R213  4.7K  [R0402]
R214  4.7K  [R0402]
U10  YT8521SH-CA  [QFN48]
Y6  X322525MSB4SI  [3225]

### Nets
3V3: R203.1 R204.1 R213.1
AVDD33: C316.1 C317.1 R203.2 U10.1(AVDD33) U10.12(AVDD332)
AVDDL: C312.1 C313.1 C314.1 R201.2 U10.4(AVDDL) U10.9(AVDDL1) U10.47(AVDDL3)
DVDD33: C318.1 C319.1 C320.1 R200.1 R204.2 R208.2 U10.30(DVDD33) U10.31(VDD33_LX)
DVDD_RGMII: C321.1 C322.1 R205.2 R207.2 R209.2 R214.2 U10.29(DVDD_RGMII)
DVDDL: C315.1 R202.2 U10.22(DVDDL)
GND: C308.2 C309.2 C310.2 C311.2 C312.2 C313.2 C314.2 C315.2 C316.2 C317.2 C318.2 C319.2 C320.2 C321.2 C322.2 R199.1 R206.2 R210.2 R211.2 R212.2 U10.49(EP) Y6.2 Y6.4
VDDL: C310.1 C311.1 L14.2 R201.1 R202.1
CLKOUT: U10.44(CLKOUT)
ETH_MDC: U10.14(MDC)
ETH_MDIO: R209.1 U10.15(MDIO)
ETH_RX_DV: R214.1 U10.27(RX_DV/PHYAD2)
ETH_RXCK: R207.1 U10.28(RX_CLK/PHYAD1)
ETH_RXD0: R205.1 U10.26(RXD0/RXDLY)
ETH_RXD1: R211.1 U10.25(RXD1/CFG_MODE0)
ETH_RXD2: R212.1 U10.24(RXD2/CFG_MODE1)
ETH_RXD3: R210.1 U10.23(RXD3/CFG_MODE2)
ETH_TXCK: U10.21(TX_CLK)
ETH_TXCTL: U10.20(TX_CTL)
ETH_TXD0: U10.19(TXD0)
ETH_TXD1: U10.18(TXD1)
ETH_TXD2: U10.17(TXD2)
ETH_TXD3: U10.16(TXD3)
INT_N: R200.2 U10.34(INT_N/PME_N)
LED0/PHYAD0: R213.2 U10.35(LED0/PHYAD0)
LX: L14.1 U10.32(LX)
PHY_AD0/LED0: R206.1 U10.36(LED1/CFG_LDO0)
PHY_AD1/LED1: R208.1 U10.37(LED2/CFG_LDO1)
PHY_MDI0_N: U10.3(TRXN0)
PHY_MDI0_P: U10.2(TRXP0)
PHY_MDI1_N: U10.6(TRXN1)
PHY_MDI1_P: U10.5(TRXP1)
PHY_MDI2_N: U10.8(TRXN2)
PHY_MDI2_P: U10.7(TRXP2)
PHY_MDI3_N: U10.11(TRXN3)
PHY_MDI3_P: U10.10(TRXP3)
PS_POR_B: U10.13(RESET_N)
XTAL_IN: C309.1 U10.45(XTAL_I) Y6.3
XTAL_OUT: C308.1 U10.46(XTAL_O/EXT_CLK) Y6.1
NetR199_2: R199.2 U10.48(RBIAS)

Not connected (* = marked no-connect by the designer): U10 33(RESERVED4)* 38(HSIP)* 39(HSIN)* 40(HSOP)* 41(HSON)* 42(NC)* 43(RESERVED)*

### Notes on the sheet
- RGMII 1.8V
- (in symbol TitleBlock0) Title; Size; Document Number; Rev; Date:; Sheet; of

### Library data of the parts
C308-C322 = CAP NP
  C308 C309 C311-C317 C319 C320 C322: PCB Footprint: C0402
  C310 C318 C321: PCB Footprint: C0603
L14 = INDUCTOR: PCB Footprint: 2520
R199-R214 = RESISTOR_Dup1: PCB Footprint: R0402
U10 = YT8521S_1_U1_3: DifferentialPair: True; PCB Footprint: QFN48
Y6 = CRYSTAL_passive: PCB Footprint: 3225
*#10 = TitleBlock0: Page Create Date: March  8, 1995; Page Modify Date: *

## Sheet 11_CONNECTOR.SchDoc
size 297 x 209 mm
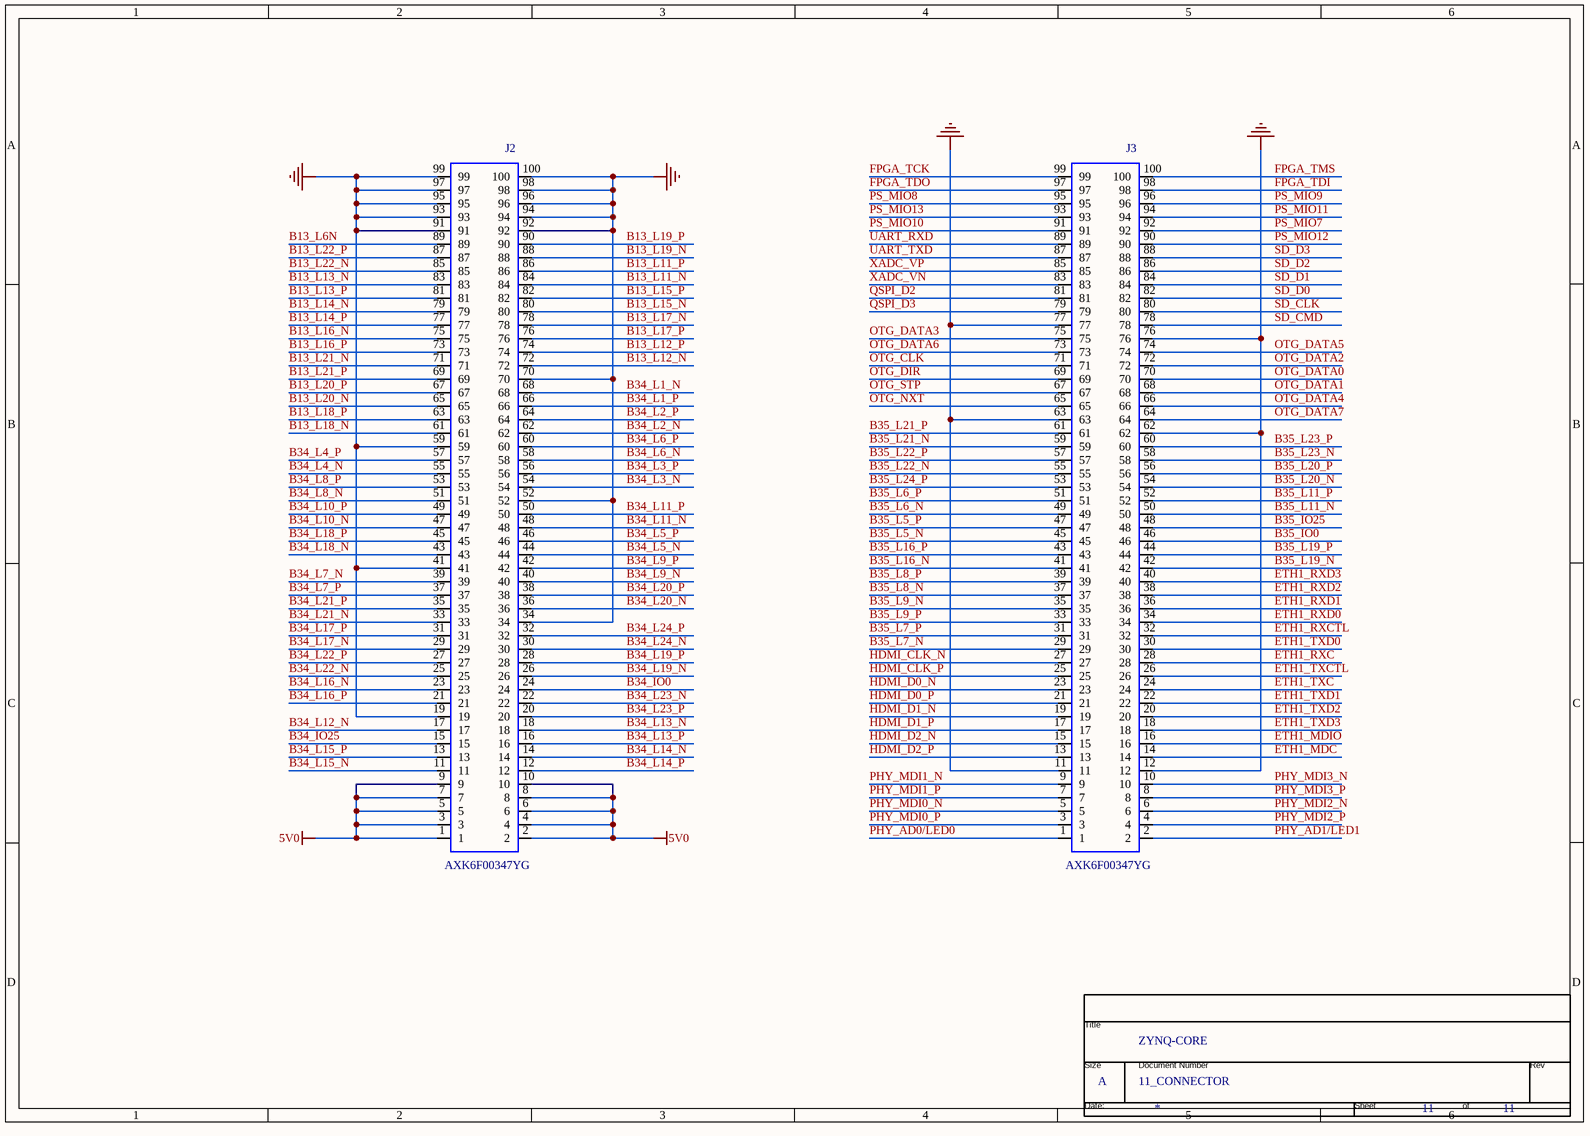
[diagram p10: 11_CONNECTOR.SchDoc]

### Parts
(Parts that share a designator on the sheet are numbered #1, #2 ... from top to bottom, then left to right.)
*#11  Page Count: 11  Page Size: A  Title: ZYNQ-CORE  Doc: 11_CONNECTOR  (hidden comment: TitleBlock0)  (graphical)
J2  AXK6F00347YG  [AXK6F00347YG_V]
J3  AXK6F00347YG  [AXK6F00347YG_V]

### Nets
5V0: J2.1 J2.2 J2.3 J2.4 J2.5 J2.6 J2.7 J2.8 J2.9 J2.10
GND: J2.19 J2.34 J2.41 J2.52 J2.59 J2.70 J2.91 J2.92 J2.93 J2.94 J2.95 J2.96 J2.97 J2.98 J2.99 J2.100 J3.11 J3.12 J3.62 J3.63 J3.76 J3.77
B13_L6N: J2.89
B13_L11_N: J2.84
B13_L11_P: J2.86
B13_L12_N: J2.72
B13_L12_P: J2.74
B13_L13_N: J2.83
B13_L13_P: J2.81
B13_L14_N: J2.79
B13_L14_P: J2.77
B13_L15_N: J2.80
B13_L15_P: J2.82
B13_L16_N: J2.75
B13_L16_P: J2.73
B13_L17_N: J2.78
B13_L17_P: J2.76
B13_L18_N: J2.61
B13_L18_P: J2.63
B13_L19_N: J2.88
B13_L19_P: J2.90
B13_L20_N: J2.65
B13_L20_P: J2.67
B13_L21_N: J2.71
B13_L21_P: J2.69
B13_L22_N: J2.85
B13_L22_P: J2.87
B34_IO0: J2.24
B34_IO25: J2.15
B34_L1_N: J2.68
B34_L1_P: J2.66
B34_L2_N: J2.62
B34_L2_P: J2.64
B34_L3_N: J2.54
B34_L3_P: J2.56
B34_L4_N: J2.55
B34_L4_P: J2.57
B34_L5_N: J2.44
B34_L5_P: J2.46
B34_L6_N: J2.58
B34_L6_P: J2.60
B34_L7_N: J2.39
B34_L7_P: J2.37
B34_L8_N: J2.51
B34_L8_P: J2.53
B34_L9_N: J2.40
B34_L9_P: J2.42
B34_L10_N: J2.47
B34_L10_P: J2.49
B34_L11_N: J2.48
B34_L11_P: J2.50
B34_L12_N: J2.17
B34_L13_N: J2.18
B34_L13_P: J2.16
B34_L14_N: J2.14
B34_L14_P: J2.12
B34_L15_N: J2.11
B34_L15_P: J2.13
B34_L16_N: J2.23
B34_L16_P: J2.21
B34_L17_N: J2.29
B34_L17_P: J2.31
B34_L18_N: J2.43
B34_L18_P: J2.45
B34_L19_N: J2.26
B34_L19_P: J2.28
B34_L20_N: J2.36
B34_L20_P: J2.38
B34_L21_N: J2.33
B34_L21_P: J2.35
B34_L22_N: J2.25
B34_L22_P: J2.27
B34_L23_N: J2.22
B34_L23_P: J2.20
B34_L24_N: J2.30
B34_L24_P: J2.32
B35_IO0: J3.46
B35_IO25: J3.48
B35_L5_N: J3.45
B35_L5_P: J3.47
B35_L6_N: J3.49
B35_L6_P: J3.51
B35_L7_N: J3.29
B35_L7_P: J3.31
B35_L8_N: J3.37
B35_L8_P: J3.39
B35_L9_N: J3.35
B35_L9_P: J3.33
B35_L11_N: J3.50
B35_L11_P: J3.52
B35_L16_N: J3.41
B35_L16_P: J3.43
B35_L19_N: J3.42
B35_L19_P: J3.44
B35_L20_N: J3.54
B35_L20_P: J3.56
B35_L21_N: J3.59
B35_L21_P: J3.61
B35_L22_N: J3.55
B35_L22_P: J3.57
B35_L23_N: J3.58
B35_L23_P: J3.60
B35_L24_P: J3.53
ETH1_MDC: J3.14
ETH1_MDIO: J3.16
ETH1_RXC: J3.28
ETH1_RXCTL: J3.32
ETH1_RXD0: J3.34
ETH1_RXD1: J3.36
ETH1_RXD2: J3.38
ETH1_RXD3: J3.40
ETH1_TXC: J3.24
ETH1_TXCTL: J3.26
ETH1_TXD0: J3.30
ETH1_TXD1: J3.22
ETH1_TXD2: J3.20
ETH1_TXD3: J3.18
FPGA_TCK: J3.99
FPGA_TDI: J3.98
FPGA_TDO: J3.97
FPGA_TMS: J3.100
HDMI_CLK_N: J3.27
HDMI_CLK_P: J3.25
HDMI_D0_N: J3.23
HDMI_D0_P: J3.21
HDMI_D1_N: J3.19
HDMI_D1_P: J3.17
HDMI_D2_N: J3.15
HDMI_D2_P: J3.13
OTG_CLK: J3.71
OTG_DATA0: J3.70
OTG_DATA1: J3.68
OTG_DATA2: J3.72
OTG_DATA3: J3.75
OTG_DATA4: J3.66
OTG_DATA5: J3.74
OTG_DATA6: J3.73
OTG_DATA7: J3.64
OTG_DIR: J3.69
OTG_NXT: J3.65
OTG_STP: J3.67
PHY_AD0/LED0: J3.1
PHY_AD1/LED1: J3.2
PHY_MDI0_N: J3.5
PHY_MDI0_P: J3.3
PHY_MDI1_N: J3.9
PHY_MDI1_P: J3.7
PHY_MDI2_N: J3.6
PHY_MDI2_P: J3.4
PHY_MDI3_N: J3.10
PHY_MDI3_P: J3.8
PS_MIO7: J3.92
PS_MIO8: J3.95
PS_MIO9: J3.96
PS_MIO10: J3.91
PS_MIO11: J3.94
PS_MIO12: J3.90
PS_MIO13: J3.93
QSPI_D2: J3.81
QSPI_D3: J3.79
SD_CLK: J3.80
SD_CMD: J3.78
SD_D0: J3.82
SD_D1: J3.84
SD_D2: J3.86
SD_D3: J3.88
UART_RXD: J3.89
UART_TXD: J3.87
XADC_VN: J3.83
XADC_VP: J3.85

### Notes on the sheet
- (in symbol TitleBlock0) Title; Size; Document Number; Rev; Date:; Sheet; of

### Library data of the parts
J2 J3 = Header_2X50: Header_2X50_0.5mm; PCB Footprint: H0_8X2X50_B
*#11 = TitleBlock0: Page Number: 11; Page Create Date: March  8, 1995; Page Modify Date: *